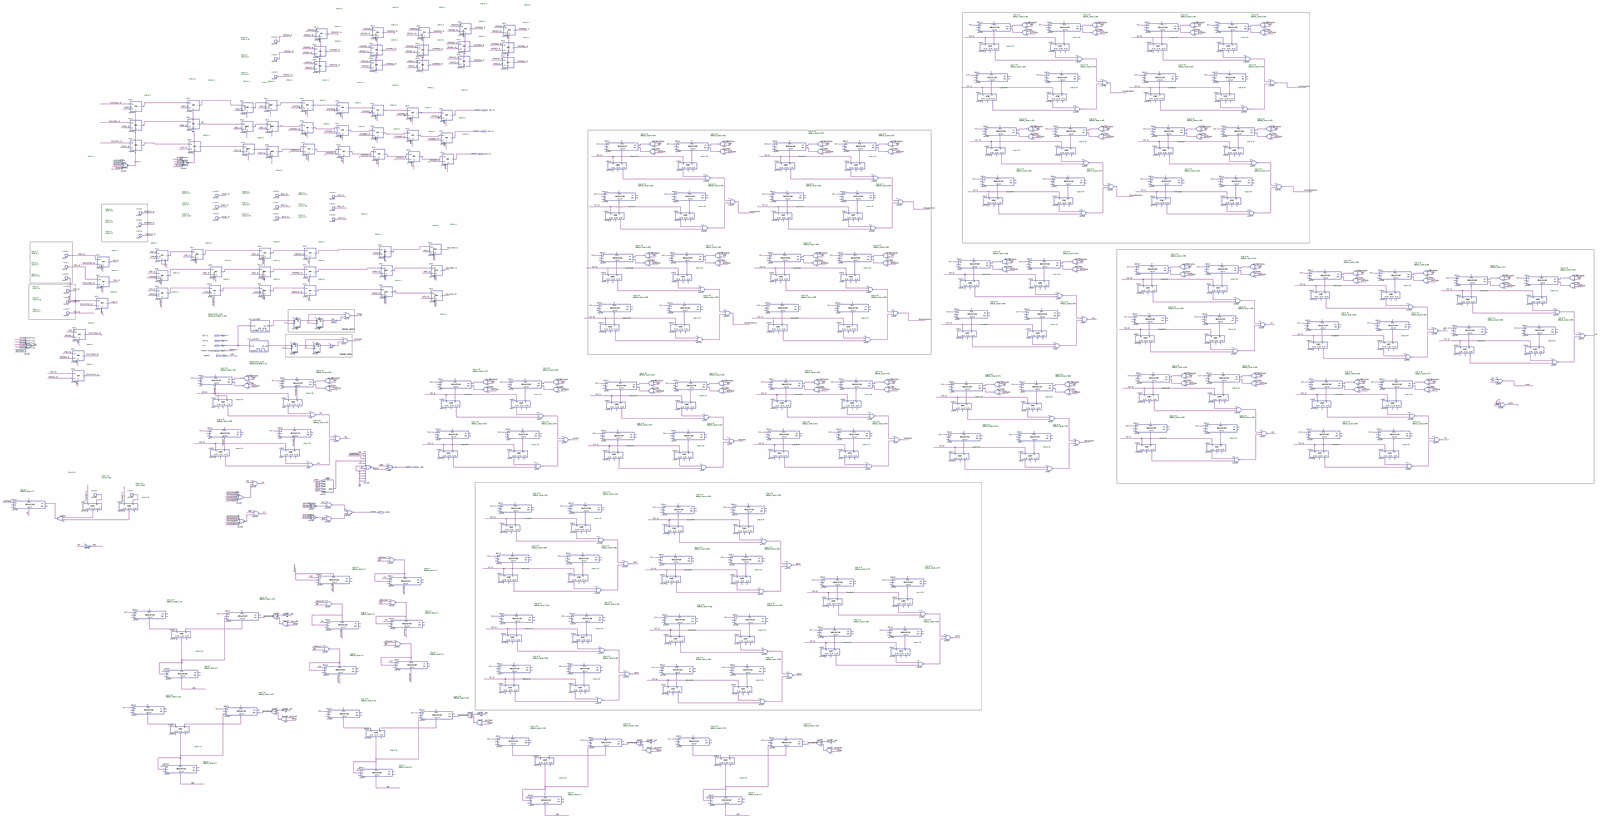
[diagram p0: schematic sheet, whole]
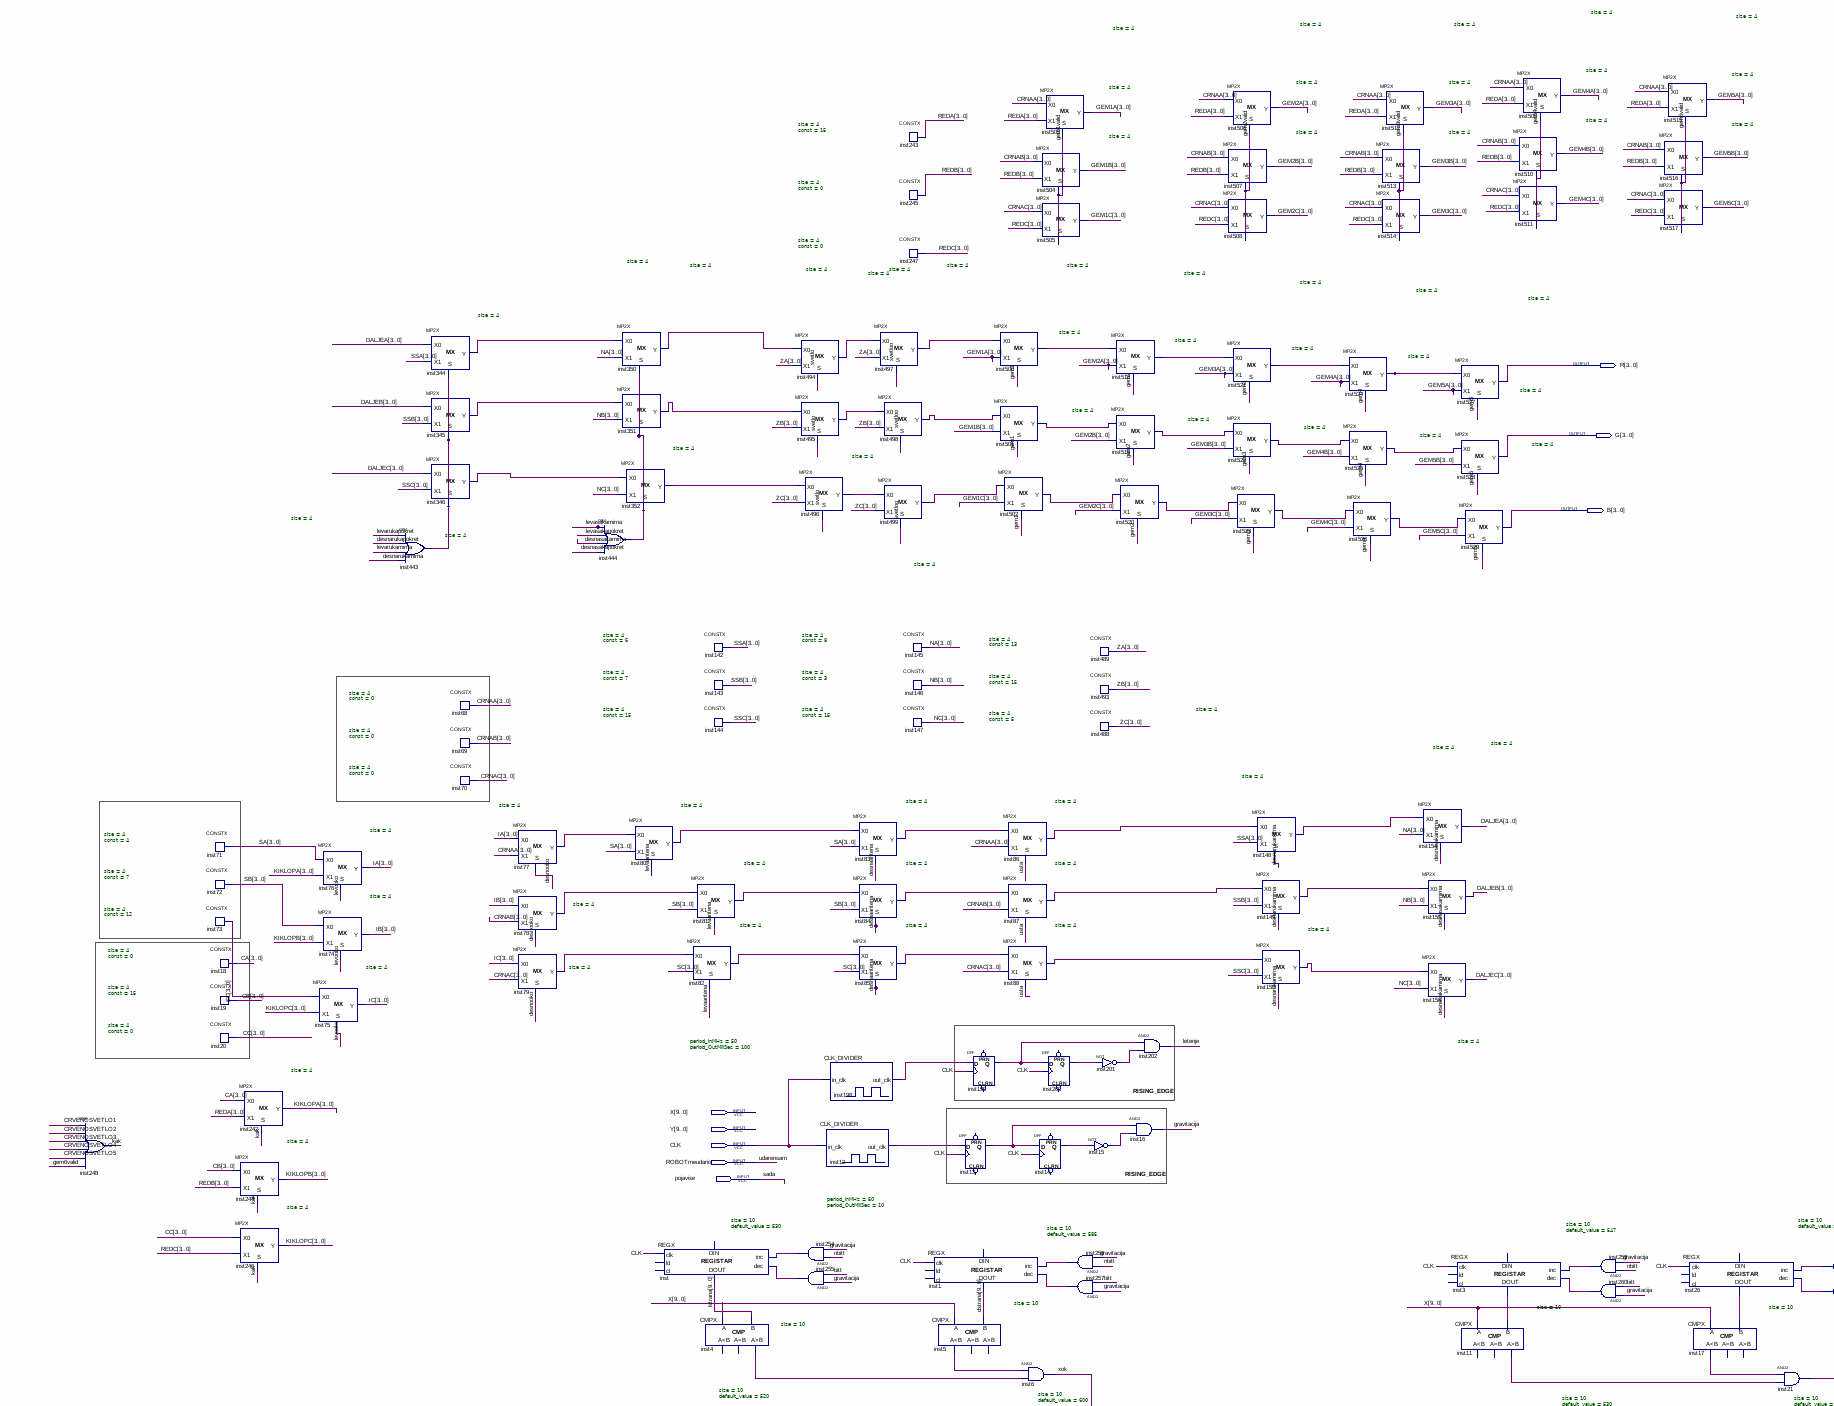
[diagram p1: schematic sheet, upper left part]
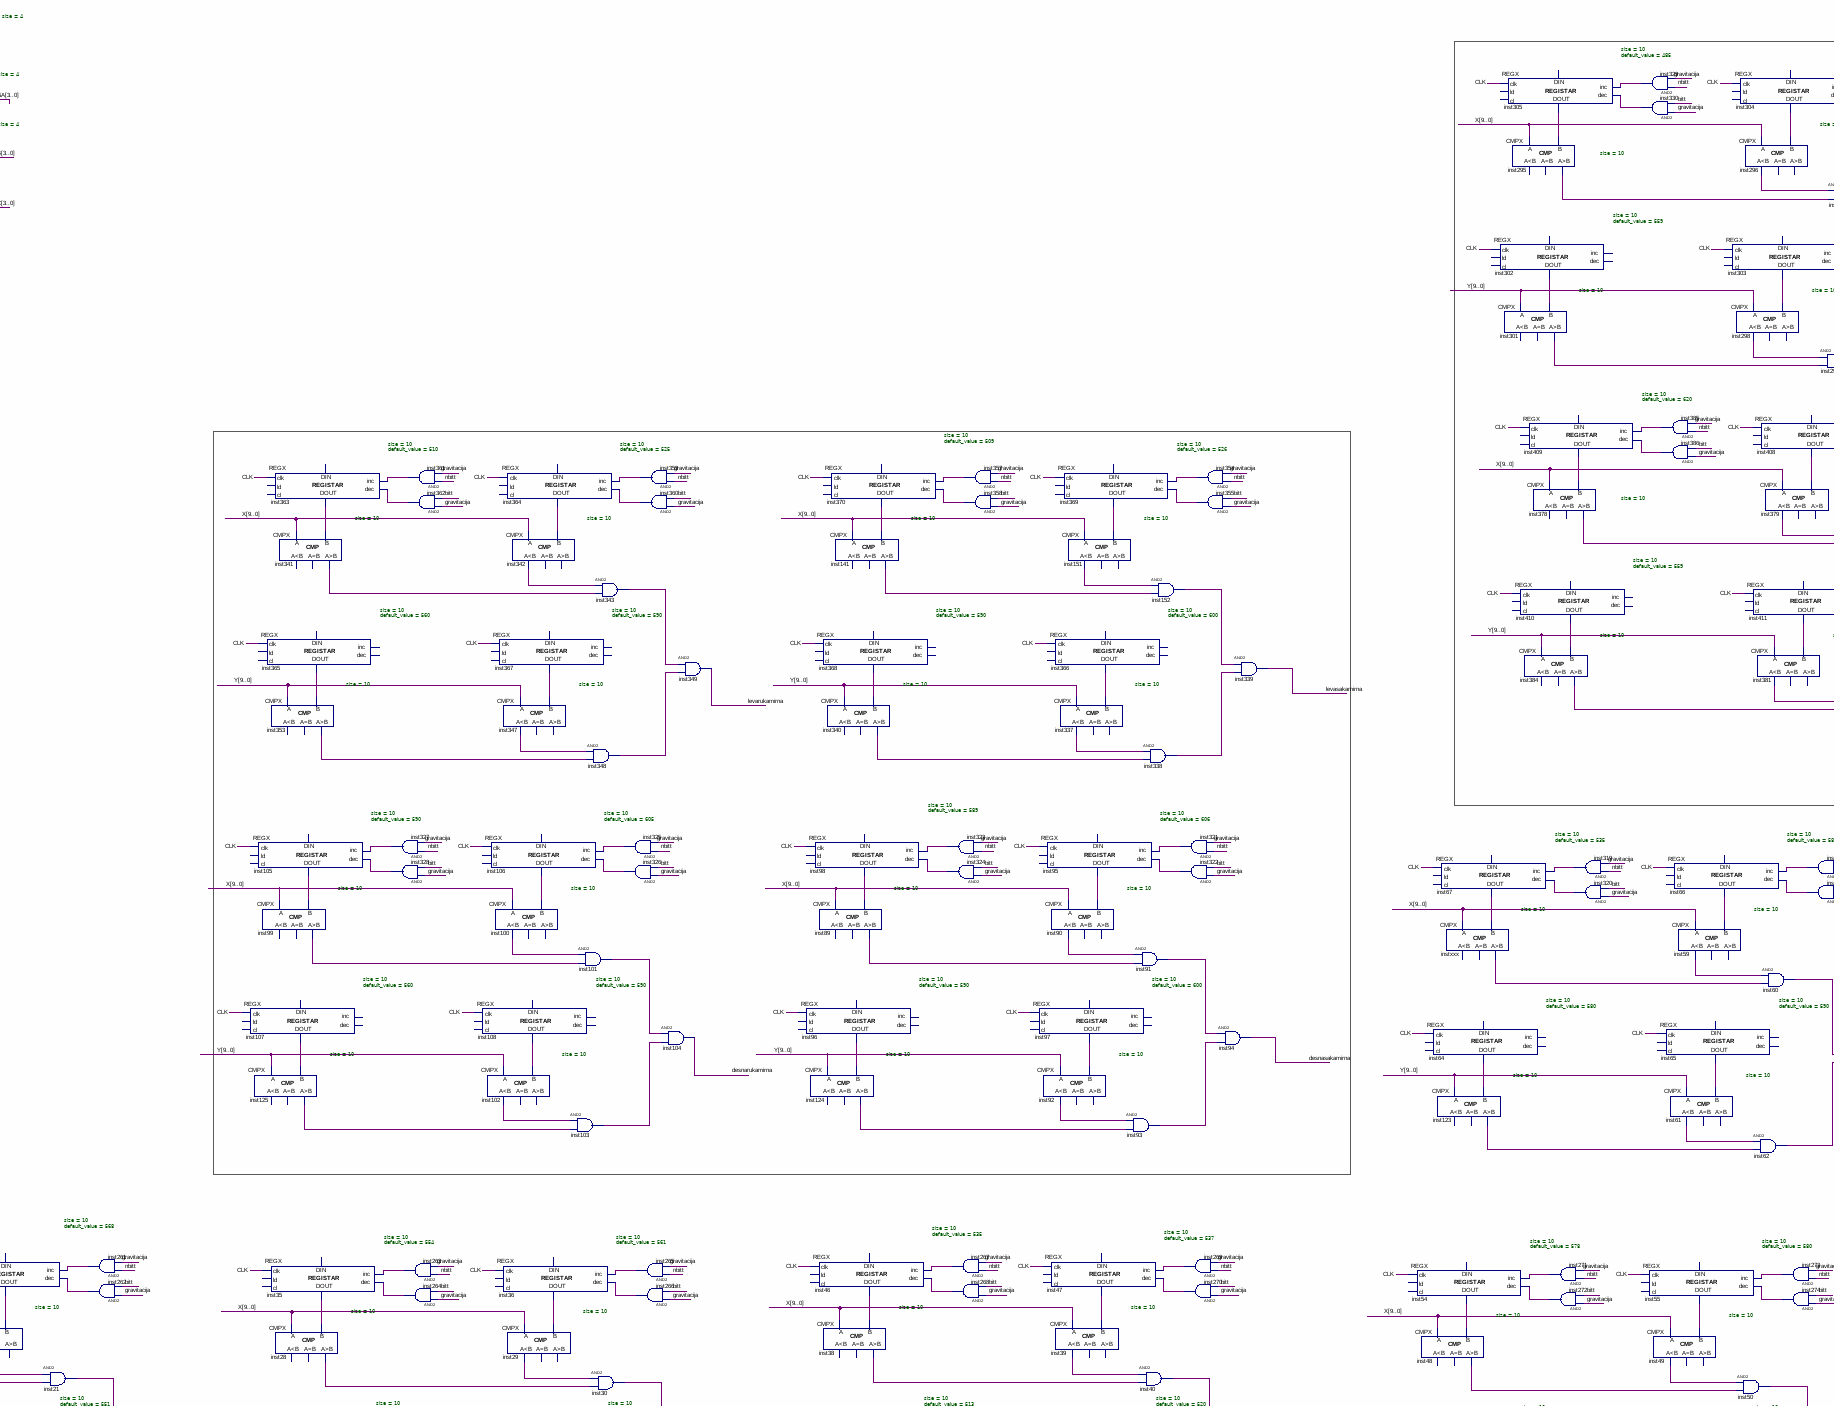
[diagram p2: schematic sheet, upper centre part]
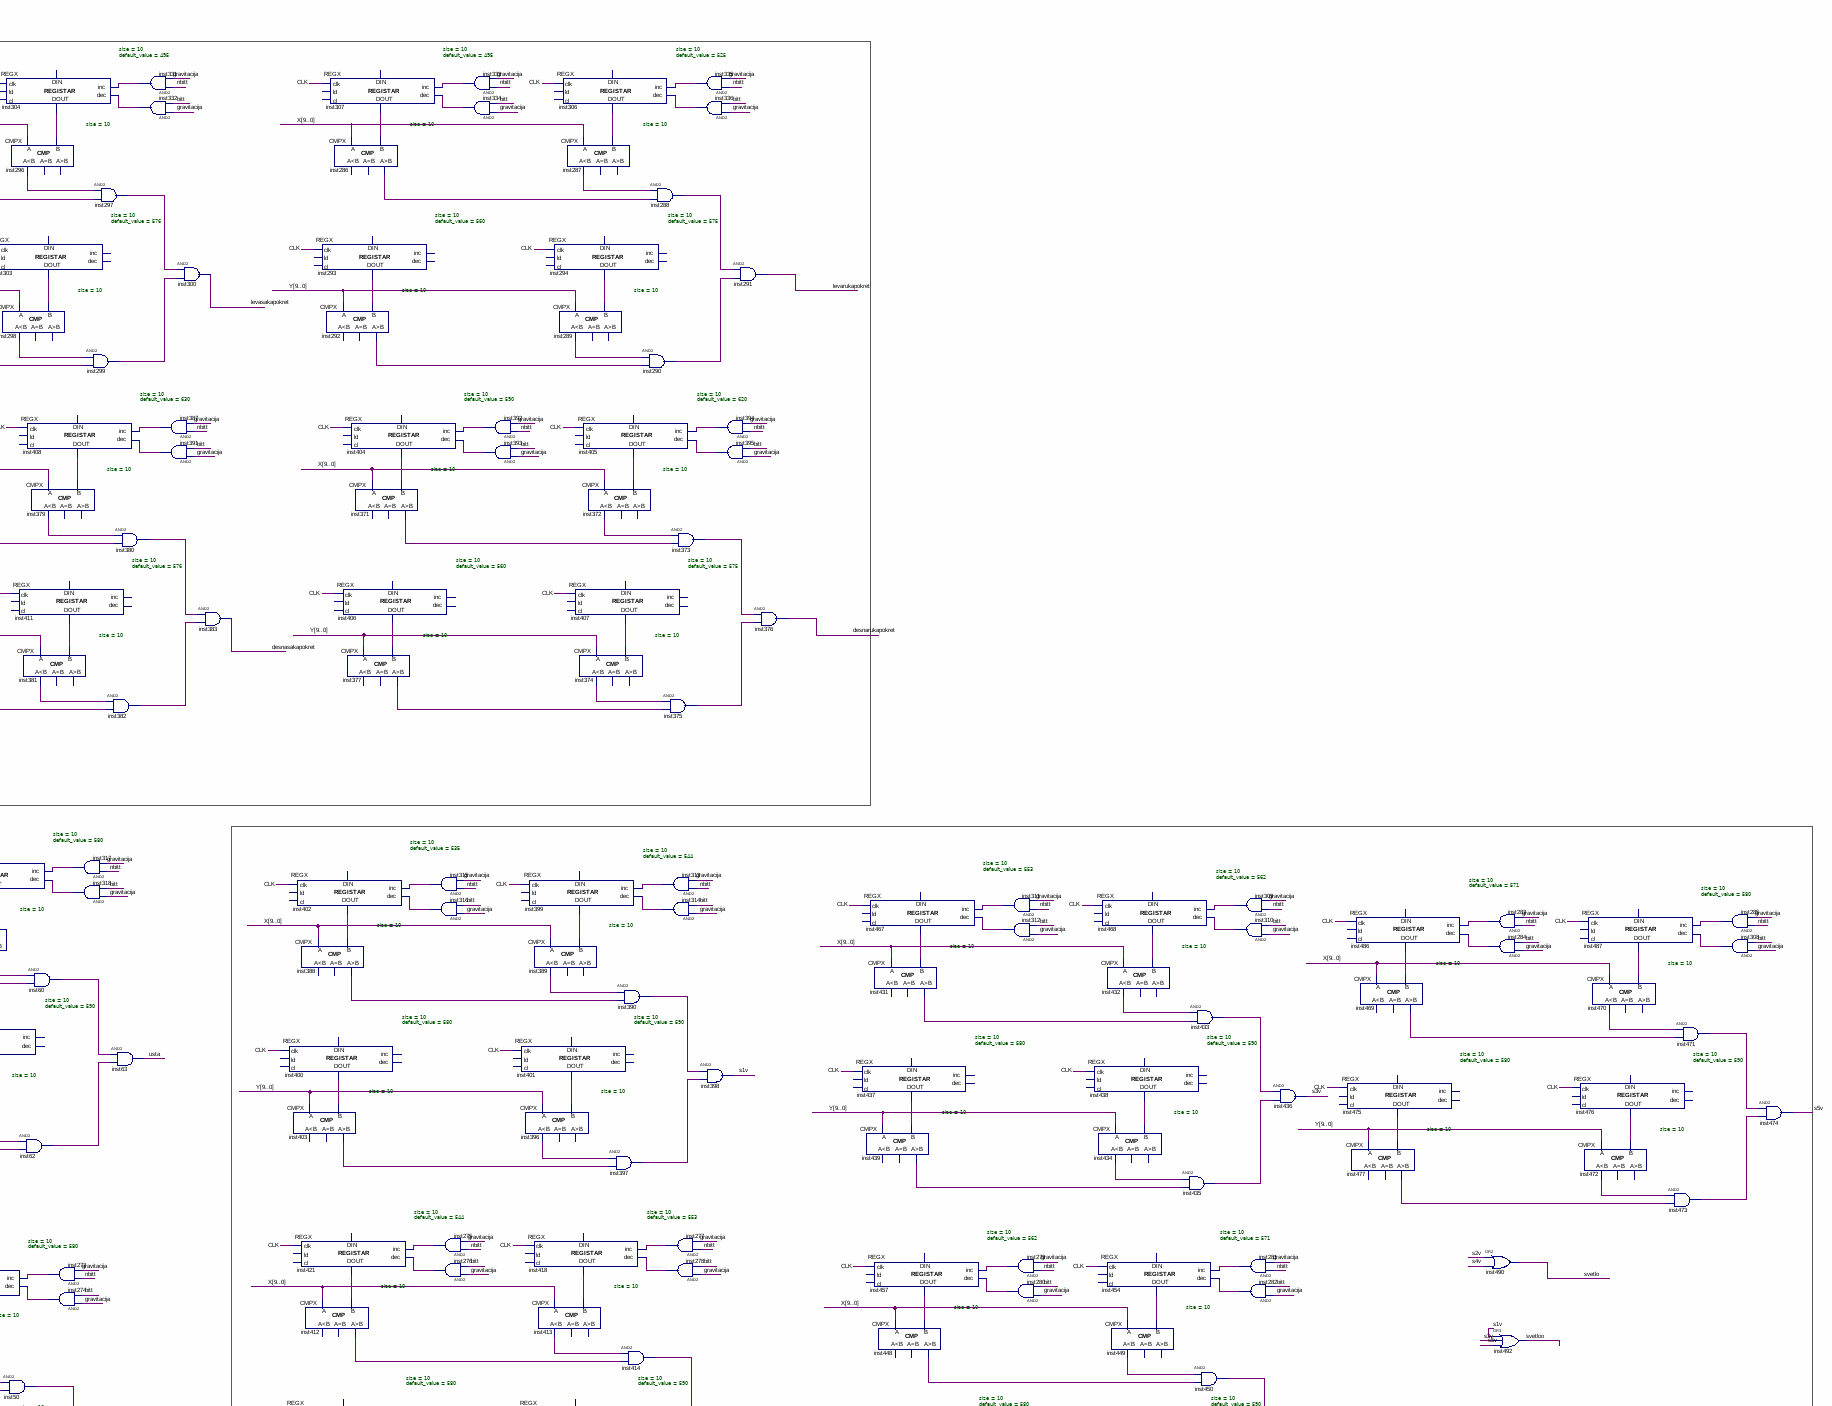
[diagram p3: schematic sheet, upper right part]
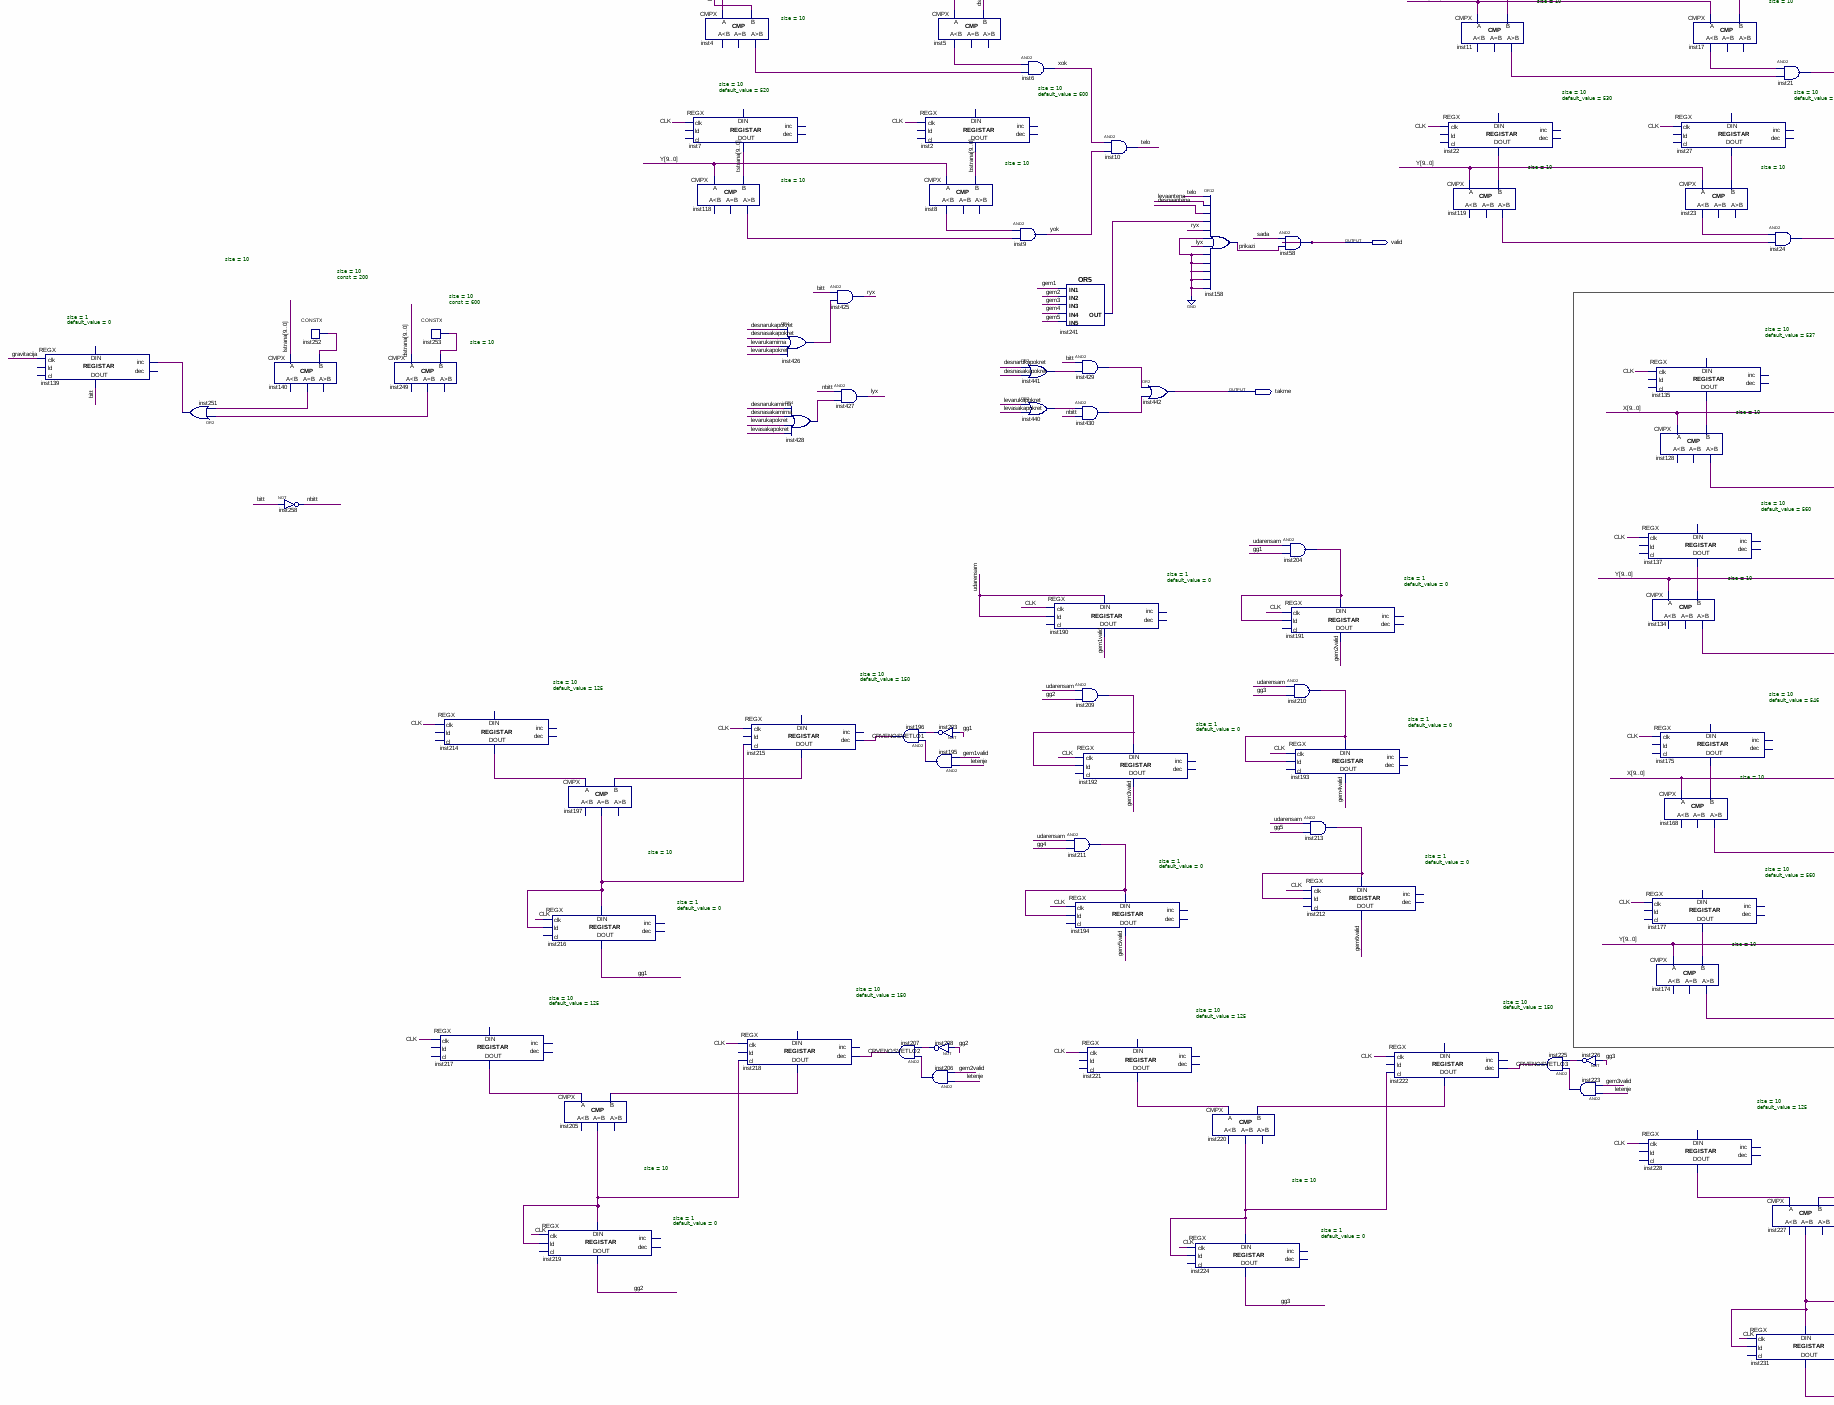
[diagram p4: schematic sheet, lower left part]
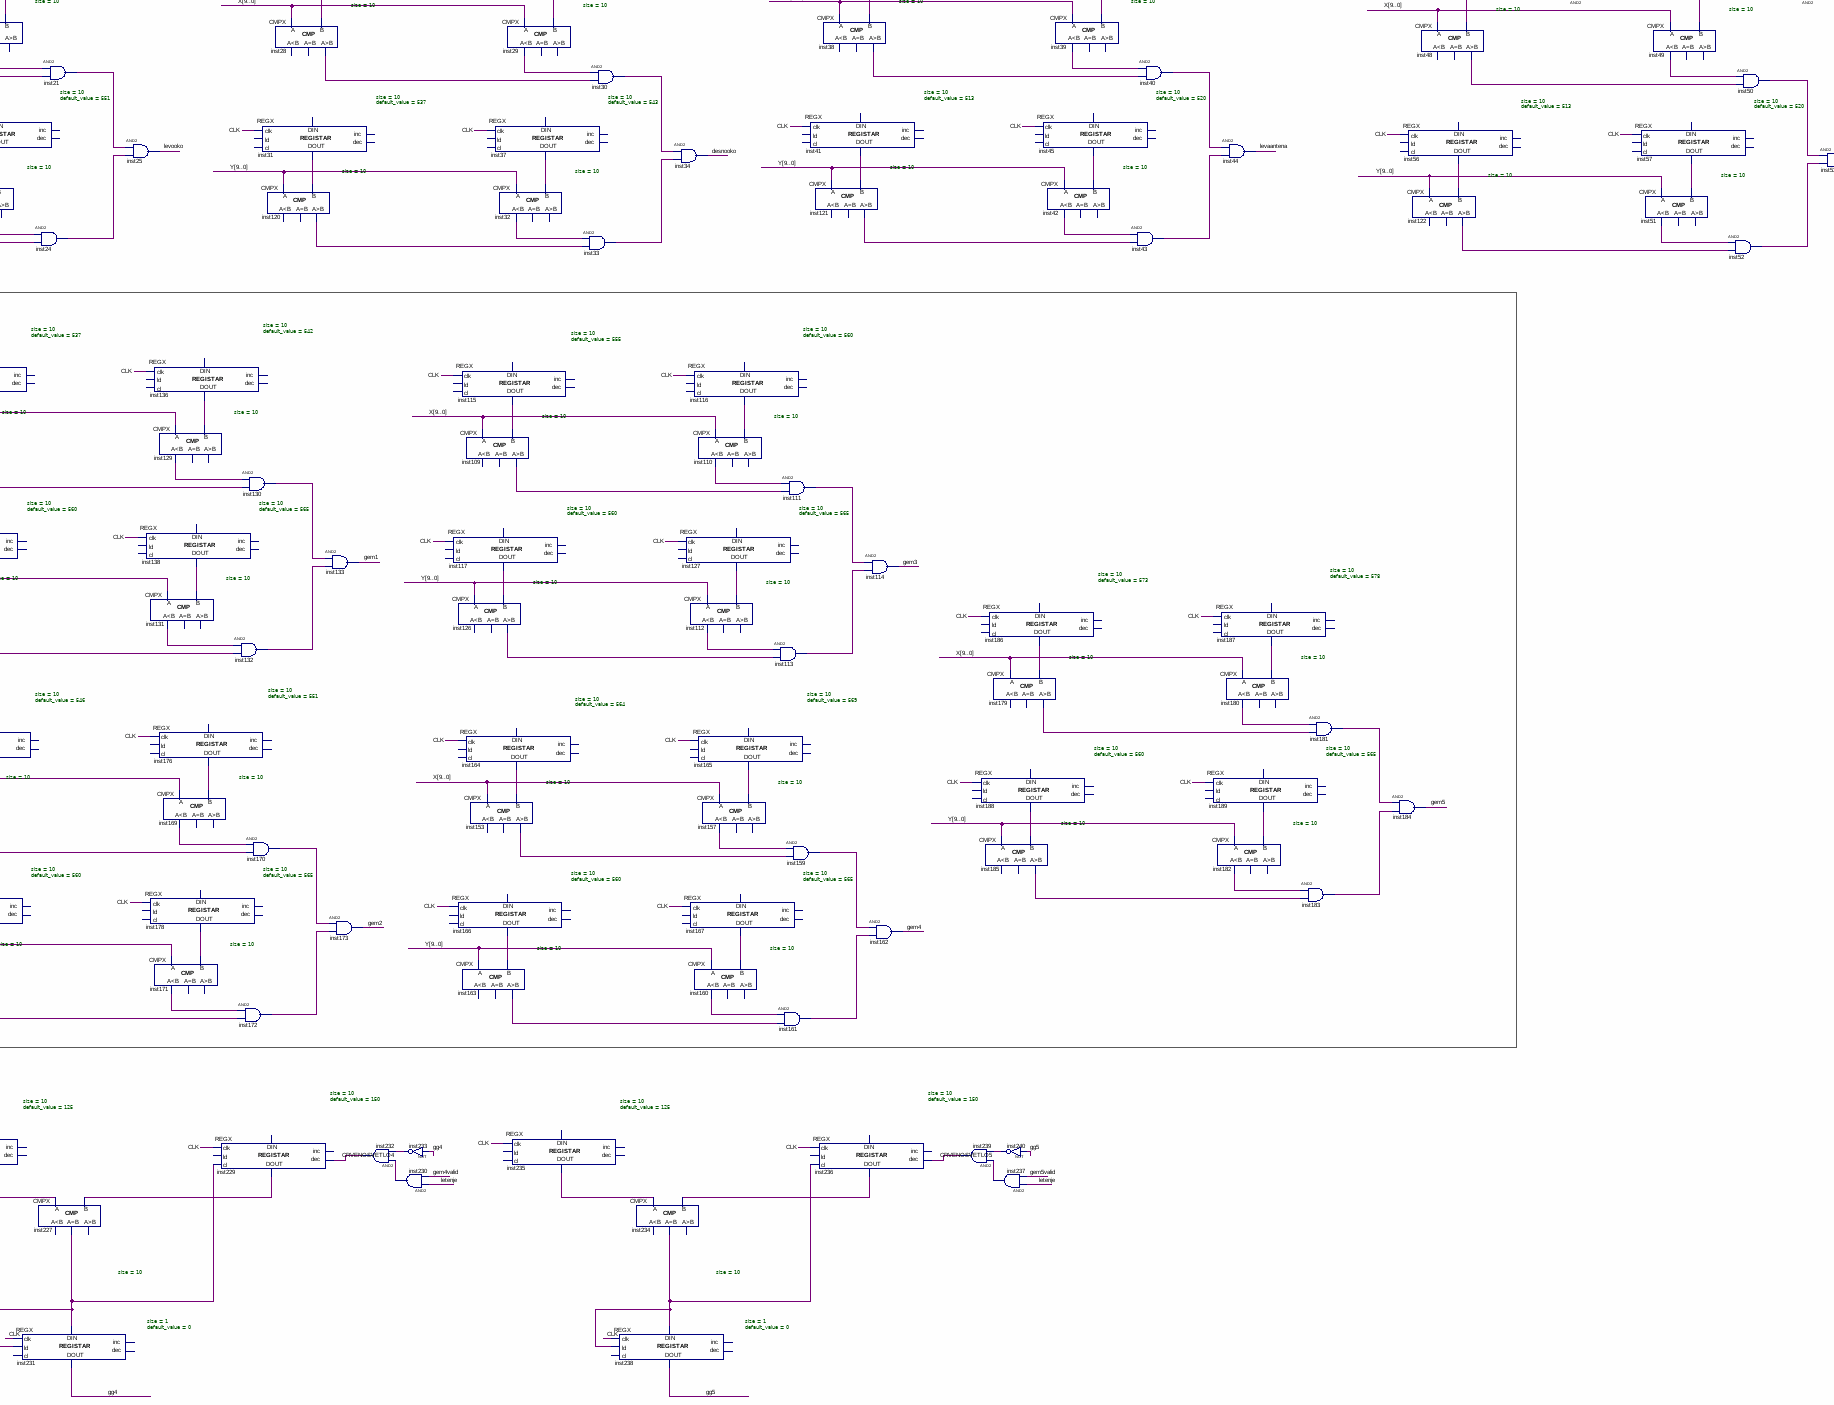
[diagram p5: schematic sheet, lower centre part]
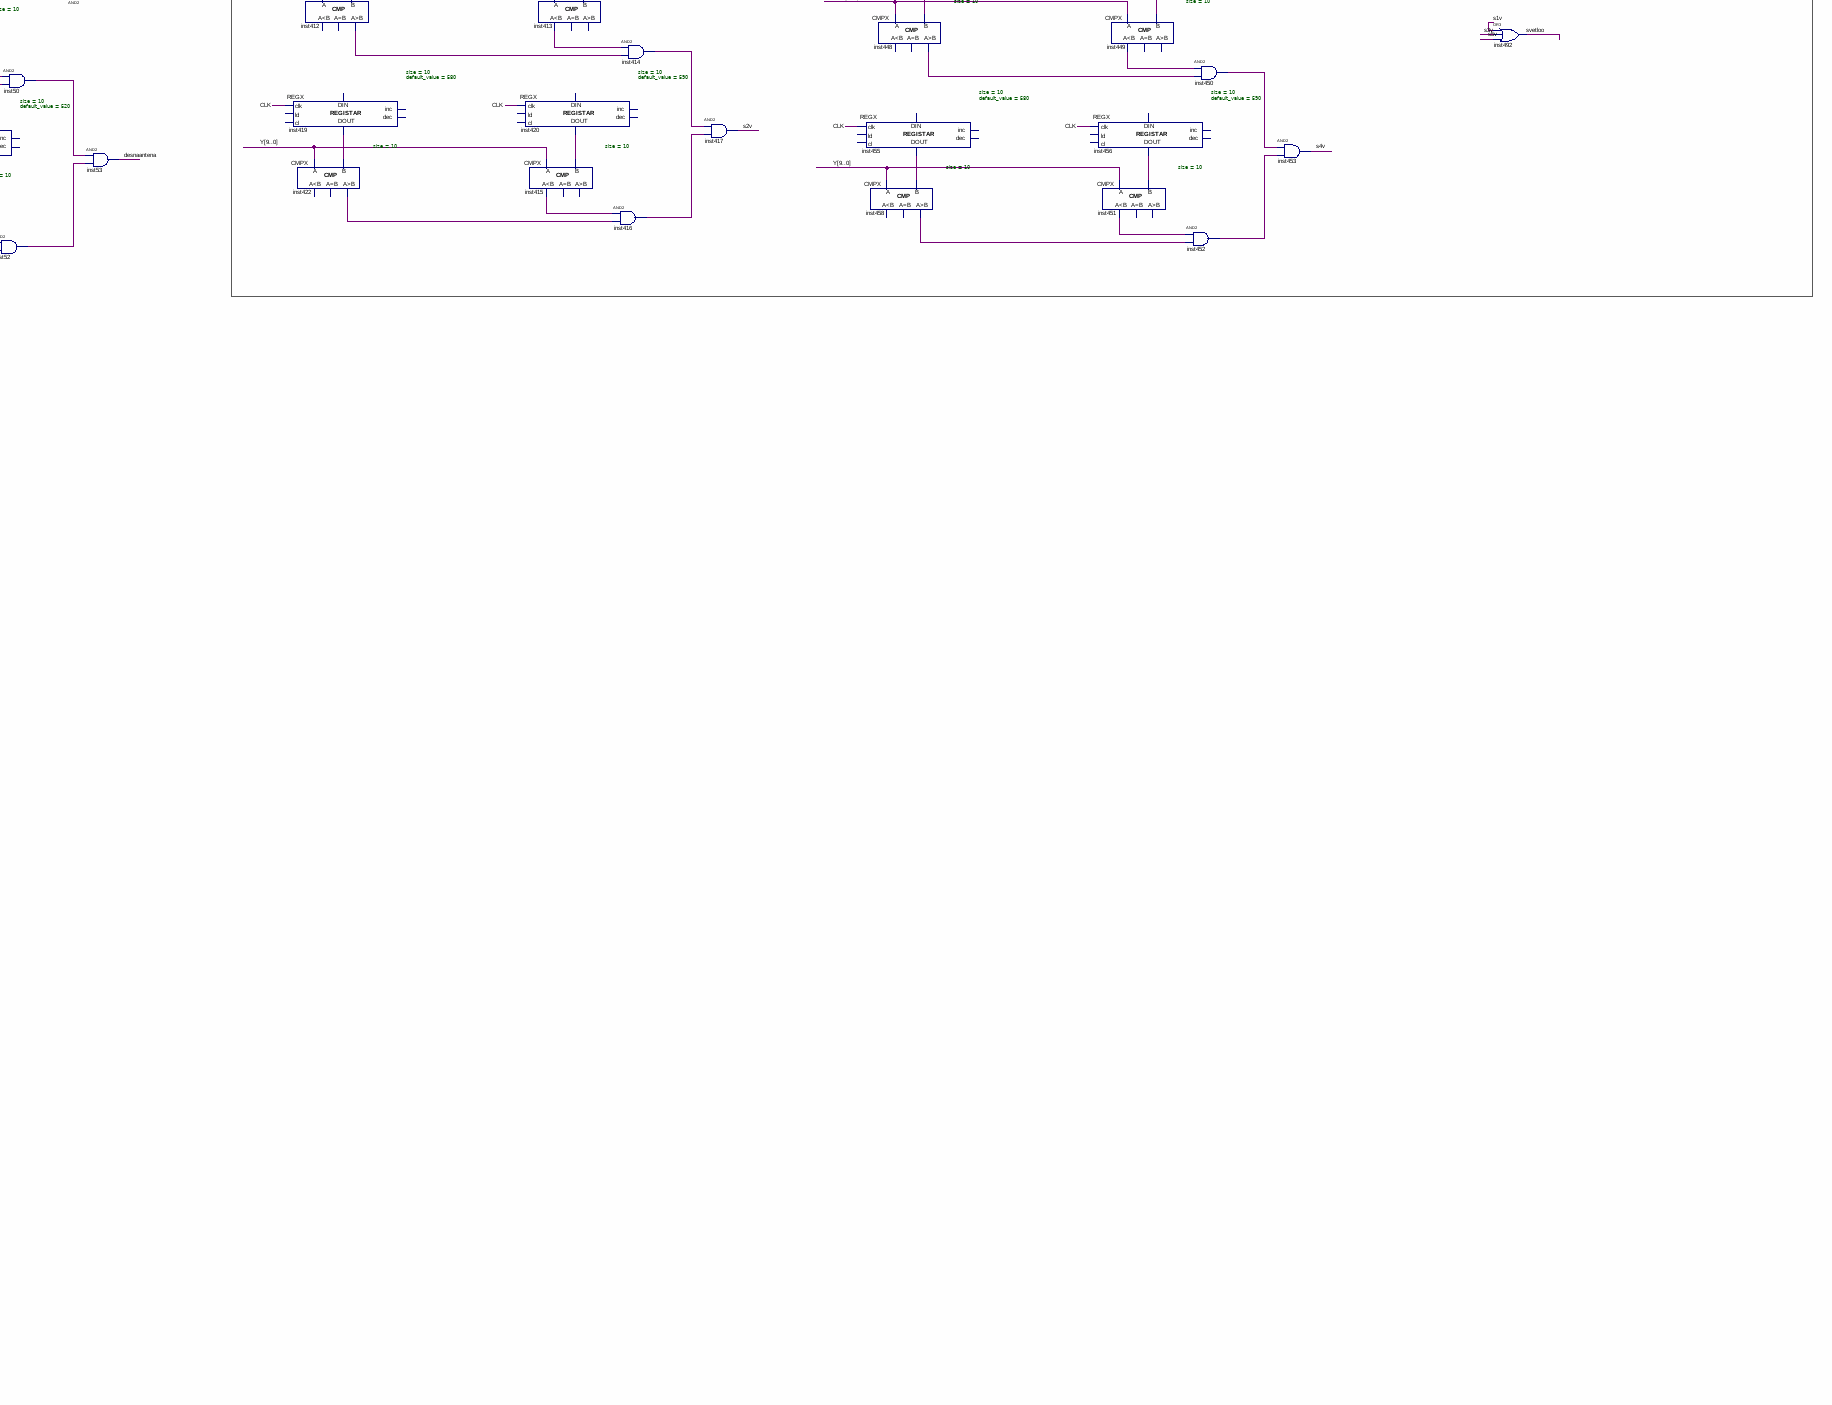
[diagram p6: schematic sheet, lower right part]
// Quartus schematic FINALBOSS.bdf as structural Verilog: 507 symbols, 10 pins
module FINALBOSS (
  input  [9:0] X,
  input  [9:0] Y,
  input  CLK,
  input  ROBOTmeudario,
  input  pojavise,
  output [3:0] R,
  output [3:0] G,
  output [3:0] B,
  output valid,
  output takme
);

  wire bitt, CRVENOSVETLO1, CRVENOSVETLO2, CRVENOSVETLO3, CRVENOSVETLO4, CRVENOSVETLO5, desnaantena,
       desnarukamirna, desnarukapokret, desnasakamirna, desnasakapokret, desnooko, gem1, gem1valid, gem2,
       gem2valid, gem3, gem3valid, gem4, gem4valid, gem5, gem5valid, gem6valid, gg1, gg2, gg3, gg4, gg5,
       gravitacija, inst4_gr, inst5_ls, inst8_ls, inst11_gr, inst12_out_clk, inst13_q, inst14_q, inst15_out,
       inst17_ls, inst21_out, inst23_ls, inst24_out, inst28_gr, inst29_ls, inst30_out, inst32_ls, inst33_out,
       inst38_gr, inst39_ls, inst40_out, inst42_ls, inst43_out, inst48_gr, inst49_ls, inst50_out, inst51_ls,
       inst52_out, inst59_ls, inst60_out, inst61_ls, inst62_out, inst89_gr, inst90_ls, inst91_out, inst92_ls,
       inst93_out, inst99_gr, inst100_ls, inst101_out, inst102_ls, inst103_out, inst109_gr, inst110_ls,
       inst111_out, inst112_ls, inst113_out, inst118_gr, inst119_gr, inst120_gr, inst121_gr, inst122_gr,
       inst123_gr, inst124_gr, inst125_gr, inst126_gr, inst128_gr, inst129_ls, inst130_out, inst131_ls,
       inst132_out, inst134_gr, inst140_eq, inst141_gr, inst151_ls, inst152_out, inst153_gr, inst157_ls,
       inst159_out, inst160_ls, inst161_out, inst163_gr, inst168_gr, inst169_ls, inst170_out, inst171_ls,
       inst172_out, inst174_gr, inst179_gr, inst180_ls, inst181_out, inst182_ls, inst183_out, inst185_gr,
       inst195_out, inst197_eq, inst198_out_clk, inst199_q, inst200_q, inst201_out, inst203_out, inst204_out,
       inst205_eq, inst206_out, inst208_out, inst209_out, inst210_out, inst211_out, inst213_out, inst220_eq,
       inst223_out, inst226_out, inst227_eq, inst230_out, inst233_out, inst234_eq, inst237_out, inst240_out,
       inst241_out, inst249_eq, inst251_out, inst254_out, inst255_out, inst256_out, inst257_out, inst259_out,
       inst260_out, inst261_out, inst262_out, inst263_out, inst264_out, inst265_out, inst266_out,
       inst267_out, inst268_out, inst269_out, inst270_out, inst271_out, inst272_out, inst273_out,
       inst274_out, inst275_out, inst276_out, inst277_out, inst278_out, inst279_out, inst280_out,
       inst281_out, inst282_out, inst283_out, inst284_out, inst285_out, inst286_gr, inst287_ls, inst288_out,
       inst289_ls, inst290_out, inst292_gr, inst295_gr, inst296_ls, inst297_out, inst298_ls, inst299_out,
       inst301_gr, inst308_out, inst309_out, inst310_out, inst311_out, inst312_out, inst313_out, inst314_out,
       inst315_out, inst316_out, inst317_out, inst318_out, inst319_out, inst320_out, inst321_out,
       inst322_out, inst323_out, inst324_out, inst325_out, inst326_out, inst327_out, inst328_out,
       inst329_out, inst330_out, inst331_out, inst332_out, inst333_out, inst334_out, inst335_out,
       inst336_out, inst337_ls, inst338_out, inst340_gr, inst341_gr, inst342_ls, inst343_out, inst347_ls,
       inst348_out, inst353_gr, inst354_out, inst355_out, inst357_out, inst358_out, inst359_out, inst360_out,
       inst361_out, inst362_out, inst371_gr, inst372_ls, inst373_out, inst374_ls, inst375_out, inst377_gr,
       inst378_gr, inst379_ls, inst380_out, inst381_ls, inst382_out, inst384_gr, inst385_out, inst386_out,
       inst387_out, inst388_gr, inst389_ls, inst390_out, inst391_out, inst392_out, inst393_out, inst394_out,
       inst395_out, inst396_ls, inst397_out, inst403_gr, inst412_gr, inst413_ls, inst414_out, inst415_ls,
       inst416_out, inst422_gr, inst426_out, inst428_out, inst429_out, inst430_out, inst431_gr, inst432_ls,
       inst433_out, inst434_ls, inst435_out, inst439_gr, inst440_out, inst441_out, inst443_out, inst444_out,
       inst448_gr, inst449_ls, inst450_out, inst451_ls, inst452_out, inst458_gr, inst469_gr, inst470_ls,
       inst471_out, inst472_ls, inst473_out, inst477_gr, instxxx_gr, kak, letenje, levaantena, levarukamirna,
       levarukapokret, levasakamirna, levasakapokret, levooko, lyx, nbitt, prikazi, ryx, s1v, s2v, s3v, s4v,
       s5v, svetlo, svetloo, telo, usta, xok, yok;
  wire [3:0] CA, CB, CC, CRNAA, CRNAB, CRNAC, DALJEA, DALJEB, DALJEC, GEM1A, GEM1B, GEM1C, GEM2A, GEM2B,
       GEM2C, GEM3A, GEM3B, GEM3C, GEM4A, GEM4B, GEM4C, GEM5A, GEM5B, GEM5C, IA, IB, IC, inst77_y, inst78_y,
       inst79_y, inst80_y, inst81_y, inst82_y, inst83_y, inst84_y, inst85_y, inst86_y, inst87_y, inst88_y,
       inst148_y, inst149_y, inst150_y, inst344_y, inst345_y, inst346_y, inst350_y, inst351_y, inst352_y,
       inst494_y, inst495_y, inst496_y, inst497_y, inst498_y, inst499_y, inst500_y, inst501_y, inst502_y,
       inst518_y, inst519_y, inst520_y, inst521_y, inst522_y, inst523_y, inst524_y, inst525_y, inst526_y,
       KIKLOPA, KIKLOPB, KIKLOPC, NA, NB, NC, REDA, REDB, REDC, SA, SB, SC, SSA, SSB, SSC, ZA, ZB, ZC;
  wire [9:0] bstrana, dstrana, inst3_data_out, inst22_data_out, inst26_data_out, inst27_data_out,
       inst31_data_out, inst35_data_out, inst36_data_out, inst37_data_out, inst41_data_out, inst45_data_out,
       inst46_data_out, inst47_data_out, inst54_data_out, inst55_data_out, inst56_data_out, inst57_data_out,
       inst64_data_out, inst65_data_out, inst66_data_out, inst67_data_out, inst95_data_out, inst96_data_out,
       inst97_data_out, inst98_data_out, inst105_data_out, inst106_data_out, inst107_data_out,
       inst108_data_out, inst115_data_out, inst116_data_out, inst117_data_out, inst127_data_out,
       inst135_data_out, inst136_data_out, inst137_data_out, inst138_data_out, inst164_data_out,
       inst165_data_out, inst166_data_out, inst167_data_out, inst175_data_out, inst176_data_out,
       inst177_data_out, inst178_data_out, inst186_data_out, inst187_data_out, inst188_data_out,
       inst189_data_out, inst214_data_out, inst215_data_out, inst217_data_out, inst218_data_out,
       inst221_data_out, inst222_data_out, inst228_data_out, inst229_data_out, inst235_data_out,
       inst236_data_out, inst252_data, inst253_data, inst293_data_out, inst294_data_out, inst302_data_out,
       inst303_data_out, inst304_data_out, inst305_data_out, inst306_data_out, inst307_data_out,
       inst363_data_out, inst364_data_out, inst365_data_out, inst366_data_out, inst367_data_out,
       inst368_data_out, inst369_data_out, inst370_data_out, inst399_data_out, inst400_data_out,
       inst401_data_out, inst402_data_out, inst404_data_out, inst405_data_out, inst406_data_out,
       inst407_data_out, inst408_data_out, inst409_data_out, inst410_data_out, inst411_data_out,
       inst418_data_out, inst419_data_out, inst420_data_out, inst421_data_out, inst437_data_out,
       inst438_data_out, inst454_data_out, inst455_data_out, inst456_data_out, inst457_data_out,
       inst467_data_out, inst468_data_out, inst475_data_out, inst476_data_out, inst486_data_out,
       inst487_data_out, lstrana, tstrana;

  REGX #(.size(1), .default_value(0)) inst139 (
    .clk(gravitacija), .inc(inst251_out), .data_out(bitt));  // open: ld, cl, dec, data_in
  or inst248 (kak, CRVENOSVETLO1, CRVENOSVETLO2, CRVENOSVETLO3, CRVENOSVETLO4, CRVENOSVETLO5, gem6valid);
  or inst251 (inst251_out, inst249_eq, inst140_eq);
  CONSTX #(.size(4), .\const (4)) inst71 (.data(SA));
  CONSTX #(.size(4), .\const (7)) inst72 (.data(SB));
  CONSTX #(.size(4), .\const (12)) inst73 (.data(SC));
  CONSTX #(.size(4), .\const (0)) inst18 (.data(CA));
  CONSTX #(.size(4), .\const (15)) inst19 (.data(CB));
  CONSTX #(.size(4), .\const (0)) inst20 (.data(CC));
  MP2X #(.size(4)) inst244 (.S(kak), .X0(CB), .X1(REDB), .Y(KIKLOPB));
  MP2X #(.size(4)) inst246 (.S(kak), .X0(CC), .X1(REDC), .Y(KIKLOPC));
  MP2X #(.size(4)) inst242 (.S(kak), .X0(CA), .X1(REDA), .Y(KIKLOPA));
  CMPX #(.size(10)) inst140 (.A(lstrana), .B(inst252_data), .eq(inst140_eq));  // open: ls, gr
  CONSTX #(.size(10), .\const (200)) inst252 (.data(inst252_data));
  not inst258 (nbitt, bitt);
  MP2X #(.size(4)) inst76 (.S(levooko), .X0(SA), .X1(KIKLOPA), .Y(IA));
  MP2X #(.size(4)) inst74 (.S(levooko), .X0(SB), .X1(KIKLOPB), .Y(IB));
  MP2X #(.size(4)) inst75 (.S(levooko), .X0(SC), .X1(KIKLOPC), .Y(IC));
  or inst443 (inst443_out, levarukapokret, desnarukapokret, levarukamirna, desnarukamirna);
  CMPX #(.size(10)) inst249 (.A(dstrana), .B(inst253_data), .eq(inst249_eq));  // open: ls, gr
  MP2X #(.size(4)) inst344 (.S(inst443_out), .X0(DALJEA), .X1(SSA), .Y(inst344_y));
  MP2X #(.size(4)) inst345 (.S(inst443_out), .X0(DALJEB), .X1(SSB), .Y(inst345_y));
  MP2X #(.size(4)) inst346 (.S(inst443_out), .X0(DALJEC), .X1(SSC), .Y(inst346_y));
  CONSTX #(.size(10), .\const (600)) inst253 (.data(inst253_data));
  REGX #(.size(10), .default_value(125)) inst217 (
    .clk(CLK), .data_out(inst217_data_out));  // open: ld, cl, inc, dec, data_in
  CONSTX #(.size(4), .\const (0)) inst68 (.data(CRNAA));
  CONSTX #(.size(4), .\const (0)) inst69 (.data(CRNAB));
  CONSTX #(.size(4), .\const (0)) inst70 (.data(CRNAC));
  REGX #(.size(10), .default_value(125)) inst214 (
    .clk(CLK), .data_out(inst214_data_out));  // open: ld, cl, inc, dec, data_in
  MP2X #(.size(4)) inst77 (.S(desnooko), .X0(IA), .X1(CRNAA), .Y(inst77_y));
  MP2X #(.size(4)) inst78 (.S(desnooko), .X0(IB), .X1(CRNAB), .Y(inst78_y));
  MP2X #(.size(4)) inst79 (.S(desnooko), .X0(IC), .X1(CRNAC), .Y(inst79_y));
  CMPX #(.size(10)) inst197 (.A(inst214_data_out), .B(inst215_data_out), .eq(inst197_eq));  // open: ls, gr
  REGX #(.size(1), .default_value(0)) inst216 (
    .clk(CLK), .ld(inst197_eq), .data_in(inst197_eq), .data_out(gg1));  // open: cl, inc, dec
  CMPX #(.size(10)) inst205 (.A(inst217_data_out), .B(inst218_data_out), .eq(inst205_eq));  // open: ls, gr
  REGX #(.size(1), .default_value(0)) inst219 (
    .clk(CLK), .ld(inst205_eq), .data_in(inst205_eq), .data_out(gg2));  // open: cl, inc, dec
  or inst444 (inst444_out, levasakamirna, levasakapokret, desnasakamirna, desnasakapokret);
  MP2X #(.size(4)) inst350 (.S(inst444_out), .X0(inst344_y), .X1(NA), .Y(inst350_y));
  MP2X #(.size(4)) inst351 (.S(inst444_out), .X0(inst345_y), .X1(NB), .Y(inst351_y));
  MP2X #(.size(4)) inst352 (.S(inst444_out), .X0(inst346_y), .X1(NC), .Y(inst352_y));
  MP2X #(.size(4)) inst80 (.S(levaantena), .X0(inst77_y), .X1(SA), .Y(inst80_y));
  REGX #(.size(10), .default_value(530)) inst (
    .clk(CLK), .inc(inst254_out), .dec(inst255_out), .data_out(lstrana));  // open: ld, cl, data_in
  MP2X #(.size(4)) inst81 (.S(levaantena), .X0(inst78_y), .X1(SB), .Y(inst81_y));
  MP2X #(.size(4)) inst82 (.S(levaantena), .X0(inst79_y), .X1(SC), .Y(inst82_y));
  CMPX #(.size(10)) inst4 (.A(X), .B(lstrana), .gr(inst4_gr));  // open: ls, eq
  REGX #(.size(10), .default_value(520)) inst7 (.clk(CLK), .data_out(tstrana));  // open: ld, cl, inc, dec, data_in
  CMPX #(.size(10)) inst118 (.A(Y), .B(tstrana), .gr(inst118_gr));  // open: ls, eq
  CONSTX #(.size(4), .\const (6)) inst142 (.data(SSA));
  CONSTX #(.size(4), .\const (7)) inst143 (.data(SSB));
  CONSTX #(.size(4), .\const (15)) inst144 (.data(SSC));
  REGX #(.size(10), .default_value(150)) inst215 (
    .clk(CLK), .cl(inst197_eq), .dec(CRVENOSVETLO1), .data_out(inst215_data_out));  // open: ld, inc, data_in
  REGX #(.size(10), .default_value(150)) inst218 (
    .clk(CLK), .cl(inst205_eq), .dec(CRVENOSVETLO2), .data_out(inst218_data_out));  // open: ld, inc, data_in
  MP2X #(.size(4)) inst494 (.S(svetlo), .X0(inst350_y), .X1(ZA), .Y(inst494_y));
  MP2X #(.size(4)) inst495 (.S(svetlo), .X0(inst351_y), .X1(ZB), .Y(inst495_y));
  MP2X #(.size(4)) inst496 (.S(svetlo), .X0(inst352_y), .X1(ZC), .Y(inst496_y));
  and inst254 (inst254_out, nbitt, gravitacija);
  and inst255 (inst255_out, gravitacija, bitt);
  or inst426 (inst426_out, desnarukapokret, desnasakapokret, levarukamirna, levarukapokret);
  or inst428 (inst428_out, desnarukamirna, desnasakamirna, levarukapokret, levasakapokret);
  CLK_DIVIDER #(.period_InMHz(50), .period_OutMiliSec(100)) inst198 (.in_clk(CLK), .out_clk(inst198_out_clk));
  CLK_DIVIDER #(.period_InMHz(50), .period_OutMiliSec(10)) inst12 (.in_clk(CLK), .out_clk(inst12_out_clk));
  and inst425 (ryx, bitt, inst426_out);
  MP2X #(.size(4)) inst83 (.S(desnaantena), .X0(inst80_y), .X1(SA), .Y(inst83_y));
  MP2X #(.size(4)) inst84 (.S(desnaantena), .X0(inst81_y), .X1(SB), .Y(inst84_y));
  MP2X #(.size(4)) inst85 (.S(desnaantena), .X0(inst82_y), .X1(SC), .Y(inst85_y));
  and inst427 (lyx, nbitt, inst428_out);
  CONSTX #(.size(4), .\const (15)) inst243 (.data(REDA));
  CONSTX #(.size(4), .\const (0)) inst245 (.data(REDB));
  CONSTX #(.size(4), .\const (0)) inst247 (.data(REDC));
  MP2X #(.size(4)) inst497 (.S(svetloo), .X0(inst494_y), .X1(ZA), .Y(inst497_y));
  MP2X #(.size(4)) inst498 (.S(svetloo), .X0(inst495_y), .X1(ZB), .Y(inst498_y));
  MP2X #(.size(4)) inst499 (.S(svetloo), .X0(inst496_y), .X1(ZC), .Y(inst499_y));
  and inst196 (CRVENOSVETLO1, inst195_out, inst203_out);
  and inst207 (CRVENOSVETLO2, inst206_out, inst208_out);
  CONSTX #(.size(4), .\const (8)) inst145 (.data(NA));
  CONSTX #(.size(4), .\const (3)) inst146 (.data(NB));
  CONSTX #(.size(4), .\const (15)) inst147 (.data(NC));
  REGX #(.size(10), .default_value(585)) inst1 (
    .clk(CLK), .inc(inst256_out), .dec(inst257_out), .data_out(dstrana));  // open: ld, cl, data_in
  CMPX #(.size(10)) inst5 (.A(X), .B(dstrana), .ls(inst5_ls));  // open: eq, gr
  REGX #(.size(10), .default_value(600)) inst2 (.clk(CLK), .data_out(bstrana));  // open: ld, cl, inc, dec, data_in
  CMPX #(.size(10)) inst8 (.A(Y), .B(bstrana), .ls(inst8_ls));  // open: eq, gr
  and inst195 (inst195_out, letenje, gem1valid);
  not inst208 (inst208_out, gg2);
  and inst206 (inst206_out, letenje, gem2valid);
  DFF inst13 (.CLK(CLK), .D(inst12_out_clk), .Q(inst13_q));  // open: CLRN, PRN
  not inst203 (inst203_out, gg1);
  MP2X #(.size(4)) inst500 (.S(gem1), .X0(inst497_y), .X1(GEM1A), .Y(inst500_y));
  MP2X #(.size(4)) inst501 (.S(gem1), .X0(inst498_y), .X1(GEM1B), .Y(inst501_y));
  MP2X #(.size(4)) inst502 (.S(gem1), .X0(inst499_y), .X1(GEM1C), .Y(inst502_y));
  DFF inst199 (.CLK(CLK), .D(inst198_out_clk), .Q(inst199_q));  // open: CLRN, PRN
  MP2X #(.size(4)) inst86 (.S(usta), .X0(inst83_y), .X1(CRNAA), .Y(inst86_y));
  MP2X #(.size(4)) inst87 (.S(usta), .X0(inst84_y), .X1(CRNAB), .Y(inst87_y));
  MP2X #(.size(4)) inst88 (.S(usta), .X0(inst85_y), .X1(CRNAC), .Y(inst88_y));
  and inst6 (xok, inst5_ls, inst4_gr);
  and inst9 (yok, inst8_ls, inst118_gr);
  or inst441 (inst441_out, desnarukapokret, desnasakapokret);
  or inst440 (inst440_out, levarukapokret, levasakapokret);
  MP2X #(.size(4)) inst503 (.S(gem1valid), .X0(CRNAA), .X1(REDA), .Y(GEM1A));
  MP2X #(.size(4)) inst504 (.S(gem1valid), .X0(CRNAB), .X1(REDB), .Y(GEM1B));
  MP2X #(.size(4)) inst505 (.S(gem1valid), .X0(CRNAC), .X1(REDC), .Y(GEM1C));
  DFF inst200 (.CLK(CLK), .D(inst199_q), .Q(inst200_q));  // open: CLRN, PRN
  DFF inst14 (.CLK(CLK), .D(inst13_q), .Q(inst14_q));  // open: CLRN, PRN
  or inst241 (inst241_out, gem1, gem2, gem3, gem4, gem5);
  REGX #(.size(1), .default_value(0)) inst190 (
    .clk(CLK), .ld(ROBOTmeudario), .data_in(ROBOTmeudario), .data_out(gem1valid));  // open: cl, inc, dec
  CONSTX #(.size(4), .\const (13)) inst489 (.data(ZA));
  CONSTX #(.size(4), .\const (15)) inst493 (.data(ZB));
  CONSTX #(.size(4), .\const (5)) inst488 (.data(ZC));
  not inst201 (inst201_out, inst200_q);
  not inst15 (inst15_out, inst14_q);
  and inst256 (inst256_out, nbitt, gravitacija);
  and inst257 (inst257_out, gravitacija, bitt);
  and inst429 (inst429_out, bitt, inst441_out);
  and inst430 (inst430_out, inst440_out, nbitt);
  and inst209 (inst209_out, ROBOTmeudario, gg2);
  REGX #(.size(1), .default_value(0)) inst192 (
    .clk(CLK), .ld(inst209_out), .data_in(inst209_out), .data_out(gem3valid));  // open: cl, inc, dec
  and inst211 (inst211_out, ROBOTmeudario, gg4);
  REGX #(.size(1), .default_value(0)) inst194 (
    .clk(CLK), .ld(inst211_out), .data_in(inst211_out), .data_out(gem5valid));  // open: cl, inc, dec
  REGX #(.size(10), .default_value(125)) inst221 (
    .clk(CLK), .data_out(inst221_data_out));  // open: ld, cl, inc, dec, data_in
  MP2X #(.size(4)) inst518 (.S(gem2), .X0(inst500_y), .X1(GEM2A), .Y(inst518_y));
  MP2X #(.size(4)) inst519 (.S(gem2), .X0(inst501_y), .X1(GEM2B), .Y(inst519_y));
  MP2X #(.size(4)) inst520 (.S(gem2), .X0(inst502_y), .X1(GEM2C), .Y(inst520_y));
  and inst16 (gravitacija, inst13_q, inst15_out);
  and inst10 (telo, xok, yok);
  and inst202 (letenje, inst199_q, inst201_out);
  or inst442 (takme, inst429_out, inst430_out);
  REGX #(.size(1), .default_value(0)) inst224 (
    .clk(CLK), .ld(inst220_eq), .data_in(inst220_eq), .data_out(gg3));  // open: cl, inc, dec
  MP2X #(.size(4)) inst506 (.S(gem2valid), .X0(CRNAA), .X1(REDA), .Y(GEM2A));
  MP2X #(.size(4)) inst507 (.S(gem2valid), .X0(CRNAB), .X1(REDB), .Y(GEM2B));
  MP2X #(.size(4)) inst508 (.S(gem2valid), .X0(CRNAC), .X1(REDC), .Y(GEM2C));
  MP2X #(.size(4)) inst521 (.S(gem3), .X0(inst518_y), .X1(GEM3A), .Y(inst521_y));
  MP2X #(.size(4)) inst522 (.S(gem3), .X0(inst519_y), .X1(GEM3B), .Y(inst522_y));
  MP2X #(.size(4)) inst523 (.S(gem3), .X0(inst520_y), .X1(GEM3C), .Y(inst523_y));
  or inst158 (prikazi, telo, levaantena, desnaantena, inst241_out, ryx, 1'b0, lyx, 1'b0, 1'b0, 1'b0, 1'b0, 1'b0);
  CMPX #(.size(10)) inst220 (.A(inst221_data_out), .B(inst222_data_out), .eq(inst220_eq));  // open: ls, gr
  MP2X #(.size(4)) inst148 (.S(desnarukamirna), .X0(inst86_y), .X1(SSA), .Y(inst148_y));
  MP2X #(.size(4)) inst149 (.S(desnarukamirna), .X0(inst87_y), .X1(SSB), .Y(inst149_y));
  MP2X #(.size(4)) inst150 (.S(desnarukamirna), .X0(inst88_y), .X1(SSC), .Y(inst150_y));
  and inst58 (valid, pojavise, prikazi);
  and inst204 (inst204_out, ROBOTmeudario, gg1);
  REGX #(.size(1), .default_value(0)) inst191 (
    .clk(CLK), .ld(inst204_out), .data_in(inst204_out), .data_out(gem2valid));  // open: cl, inc, dec
  and inst210 (inst210_out, ROBOTmeudario, gg3);
  REGX #(.size(1), .default_value(0)) inst193 (
    .clk(CLK), .ld(inst210_out), .data_in(inst210_out), .data_out(gem4valid));  // open: cl, inc, dec
  and inst213 (inst213_out, ROBOTmeudario, gg5);
  REGX #(.size(1), .default_value(0)) inst212 (
    .clk(CLK), .ld(inst213_out), .data_in(inst213_out), .data_out(gem6valid));  // open: cl, inc, dec
  MP2X #(.size(4)) inst524 (.S(gem4), .X0(inst521_y), .X1(GEM4A), .Y(inst524_y));
  MP2X #(.size(4)) inst525 (.S(gem4), .X0(inst522_y), .X1(GEM4B), .Y(inst525_y));
  MP2X #(.size(4)) inst526 (.S(gem4), .X0(inst523_y), .X1(GEM4C), .Y(inst526_y));
  MP2X #(.size(4)) inst512 (.S(gem3valid), .X0(CRNAA), .X1(REDA), .Y(GEM3A));
  MP2X #(.size(4)) inst513 (.S(gem3valid), .X0(CRNAB), .X1(REDB), .Y(GEM3B));
  MP2X #(.size(4)) inst514 (.S(gem3valid), .X0(CRNAC), .X1(REDC), .Y(GEM3C));
  REGX #(.size(10), .default_value(150)) inst222 (
    .clk(CLK), .cl(inst220_eq), .dec(CRVENOSVETLO3), .data_out(inst222_data_out));  // open: ld, inc, data_in
  MP2X #(.size(4)) inst154 (.S(desnasakamirna), .X0(inst148_y), .X1(NA), .Y(DALJEA));
  MP2X #(.size(4)) inst155 (.S(desnasakamirna), .X0(inst149_y), .X1(NB), .Y(DALJEB));
  MP2X #(.size(4)) inst156 (.S(desnasakamirna), .X0(inst150_y), .X1(NC), .Y(DALJEC));
  MP2X #(.size(4)) inst527 (.S(gem5), .X0(inst524_y), .X1(GEM5A), .Y(R));
  MP2X #(.size(4)) inst528 (.S(gem5), .X0(inst525_y), .X1(GEM5B), .Y(G));
  MP2X #(.size(4)) inst529 (.S(gem5), .X0(inst526_y), .X1(GEM5C), .Y(B));
  REGX #(.size(10), .default_value(547)) inst3 (
    .clk(CLK), .inc(inst259_out), .dec(inst260_out), .data_out(inst3_data_out));  // open: ld, cl, data_in
  CMPX #(.size(10)) inst11 (.A(X), .B(inst3_data_out), .gr(inst11_gr));  // open: ls, eq
  REGX #(.size(10), .default_value(530)) inst22 (
    .clk(CLK), .data_out(inst22_data_out));  // open: ld, cl, inc, dec, data_in
  CMPX #(.size(10)) inst119 (.A(Y), .B(inst22_data_out), .gr(inst119_gr));  // open: ls, eq
  MP2X #(.size(4)) inst509 (.S(gem4valid), .X0(CRNAA), .X1(REDA), .Y(GEM4A));
  MP2X #(.size(4)) inst510 (.S(gem4valid), .X0(CRNAB), .X1(REDB), .Y(GEM4B));
  MP2X #(.size(4)) inst511 (.S(gem4valid), .X0(CRNAC), .X1(REDC), .Y(GEM4C));
  and inst225 (CRVENOSVETLO3, inst223_out, inst226_out);
  and inst259 (inst259_out, nbitt, gravitacija);
  and inst260 (inst260_out, gravitacija, bitt);
  not inst226 (inst226_out, gg3);
  and inst223 (inst223_out, letenje, gem3valid);
  MP2X #(.size(4)) inst515 (.S(gem5valid), .X0(CRNAA), .X1(REDA), .Y(GEM5A));
  MP2X #(.size(4)) inst516 (.S(gem5valid), .X0(CRNAB), .X1(REDB), .Y(GEM5B));
  MP2X #(.size(4)) inst517 (.S(gem5valid), .X0(CRNAC), .X1(REDC), .Y(GEM5C));
  REGX #(.size(10), .default_value(537)) inst135 (
    .clk(CLK), .data_out(inst135_data_out));  // open: ld, cl, inc, dec, data_in
  CMPX #(.size(10)) inst128 (.A(X), .B(inst135_data_out), .gr(inst128_gr));  // open: ls, eq
  REGX #(.size(10), .default_value(560)) inst137 (
    .clk(CLK), .data_out(inst137_data_out));  // open: ld, cl, inc, dec, data_in
  CMPX #(.size(10)) inst134 (.A(Y), .B(inst137_data_out), .gr(inst134_gr));  // open: ls, eq
  REGX #(.size(10), .default_value(546)) inst175 (
    .clk(CLK), .data_out(inst175_data_out));  // open: ld, cl, inc, dec, data_in
  CMPX #(.size(10)) inst168 (.A(X), .B(inst175_data_out), .gr(inst168_gr));  // open: ls, eq
  REGX #(.size(10), .default_value(560)) inst177 (
    .clk(CLK), .data_out(inst177_data_out));  // open: ld, cl, inc, dec, data_in
  CMPX #(.size(10)) inst174 (.A(Y), .B(inst177_data_out), .gr(inst174_gr));  // open: ls, eq
  REGX #(.size(10), .default_value(125)) inst228 (
    .clk(CLK), .data_out(inst228_data_out));  // open: ld, cl, inc, dec, data_in
  REGX #(.size(10), .default_value(568)) inst26 (
    .clk(CLK), .inc(inst261_out), .dec(inst262_out), .data_out(inst26_data_out));  // open: ld, cl, data_in
  CMPX #(.size(10)) inst17 (.A(X), .B(inst26_data_out), .ls(inst17_ls));  // open: eq, gr
  REGX #(.size(10), .default_value(551)) inst27 (
    .clk(CLK), .data_out(inst27_data_out));  // open: ld, cl, inc, dec, data_in
  CMPX #(.size(10)) inst23 (.A(Y), .B(inst27_data_out), .ls(inst23_ls));  // open: eq, gr
  REGX #(.size(1), .default_value(0)) inst231 (
    .clk(CLK), .ld(inst227_eq), .data_in(inst227_eq), .data_out(gg4));  // open: cl, inc, dec
  and inst21 (inst21_out, inst17_ls, inst11_gr);
  and inst24 (inst24_out, inst23_ls, inst119_gr);
  CMPX #(.size(10)) inst227 (.A(inst228_data_out), .B(inst229_data_out), .eq(inst227_eq));  // open: ls, gr
  and inst261 (inst261_out, nbitt, gravitacija);
  and inst262 (inst262_out, gravitacija, bitt);
  and inst25 (levooko, inst21_out, inst24_out);
  REGX #(.size(10), .default_value(542)) inst136 (
    .clk(CLK), .data_out(inst136_data_out));  // open: ld, cl, inc, dec, data_in
  CMPX #(.size(10)) inst129 (.A(X), .B(inst136_data_out), .ls(inst129_ls));  // open: eq, gr
  REGX #(.size(10), .default_value(565)) inst138 (
    .clk(CLK), .data_out(inst138_data_out));  // open: ld, cl, inc, dec, data_in
  CMPX #(.size(10)) inst131 (.A(Y), .B(inst138_data_out), .ls(inst131_ls));  // open: eq, gr
  REGX #(.size(10), .default_value(551)) inst176 (
    .clk(CLK), .data_out(inst176_data_out));  // open: ld, cl, inc, dec, data_in
  CMPX #(.size(10)) inst169 (.A(X), .B(inst176_data_out), .ls(inst169_ls));  // open: eq, gr
  REGX #(.size(10), .default_value(565)) inst178 (
    .clk(CLK), .data_out(inst178_data_out));  // open: ld, cl, inc, dec, data_in
  CMPX #(.size(10)) inst171 (.A(Y), .B(inst178_data_out), .ls(inst171_ls));  // open: eq, gr
  REGX #(.size(10), .default_value(150)) inst229 (
    .clk(CLK), .cl(inst227_eq), .dec(CRVENOSVETLO4), .data_out(inst229_data_out));  // open: ld, inc, data_in
  REGX #(.size(10), .default_value(560)) inst365 (
    .clk(CLK), .data_out(inst365_data_out));  // open: ld, cl, inc, dec, data_in
  REGX #(.size(10), .default_value(590)) inst105 (
    .clk(CLK), .inc(inst327_out), .dec(inst328_out), .data_out(inst105_data_out));  // open: ld, cl, data_in
  CMPX #(.size(10)) inst99 (.A(X), .B(inst105_data_out), .gr(inst99_gr));  // open: ls, eq
  REGX #(.size(10), .default_value(560)) inst107 (
    .clk(CLK), .data_out(inst107_data_out));  // open: ld, cl, inc, dec, data_in
  CMPX #(.size(10)) inst125 (.A(Y), .B(inst107_data_out), .gr(inst125_gr));  // open: ls, eq
  REGX #(.size(10), .default_value(537)) inst31 (
    .clk(CLK), .data_out(inst31_data_out));  // open: ld, cl, inc, dec, data_in
  CMPX #(.size(10)) inst120 (.A(Y), .B(inst31_data_out), .gr(inst120_gr));  // open: ls, eq
  and inst130 (inst130_out, inst129_ls, inst128_gr);
  and inst132 (inst132_out, inst131_ls, inst134_gr);
  and inst170 (inst170_out, inst169_ls, inst168_gr);
  and inst172 (inst172_out, inst171_ls, inst174_gr);
  REGX #(.size(10), .default_value(510)) inst363 (
    .clk(CLK), .inc(inst361_out), .dec(inst362_out), .data_out(inst363_data_out));  // open: ld, cl, data_in
  CMPX #(.size(10)) inst341 (.A(X), .B(inst363_data_out), .gr(inst341_gr));  // open: ls, eq
  CMPX #(.size(10)) inst353 (.A(Y), .B(inst365_data_out), .gr(inst353_gr));  // open: ls, eq
  REGX #(.size(10), .default_value(554)) inst35 (
    .clk(CLK), .inc(inst263_out), .dec(inst264_out), .data_out(inst35_data_out));  // open: ld, cl, data_in
  CMPX #(.size(10)) inst28 (.A(X), .B(inst35_data_out), .gr(inst28_gr));  // open: ls, eq
  and inst133 (gem1, inst130_out, inst132_out);
  and inst173 (gem2, inst170_out, inst172_out);
  and inst327 (inst327_out, nbitt, gravitacija);
  and inst328 (inst328_out, gravitacija, bitt);
  and inst232 (CRVENOSVETLO4, inst230_out, inst233_out);
  and inst361 (inst361_out, nbitt, gravitacija);
  and inst362 (inst362_out, gravitacija, bitt);
  and inst263 (inst263_out, nbitt, gravitacija);
  and inst264 (inst264_out, gravitacija, bitt);
  not inst233 (inst233_out, gg4);
  and inst230 (inst230_out, letenje, gem4valid);
  REGX #(.size(10), .default_value(555)) inst115 (
    .clk(CLK), .data_out(inst115_data_out));  // open: ld, cl, inc, dec, data_in
  CMPX #(.size(10)) inst109 (.A(X), .B(inst115_data_out), .gr(inst109_gr));  // open: ls, eq
  REGX #(.size(10), .default_value(560)) inst117 (
    .clk(CLK), .data_out(inst117_data_out));  // open: ld, cl, inc, dec, data_in
  CMPX #(.size(10)) inst126 (.A(Y), .B(inst117_data_out), .gr(inst126_gr));  // open: ls, eq
  REGX #(.size(10), .default_value(564)) inst164 (
    .clk(CLK), .data_out(inst164_data_out));  // open: ld, cl, inc, dec, data_in
  REGX #(.size(10), .default_value(560)) inst166 (
    .clk(CLK), .data_out(inst166_data_out));  // open: ld, cl, inc, dec, data_in
  CMPX #(.size(10)) inst163 (.A(Y), .B(inst166_data_out), .gr(inst163_gr));  // open: ls, eq
  REGX #(.size(10), .default_value(590)) inst367 (
    .clk(CLK), .data_out(inst367_data_out));  // open: ld, cl, inc, dec, data_in
  REGX #(.size(10), .default_value(605)) inst106 (
    .clk(CLK), .inc(inst325_out), .dec(inst326_out), .data_out(inst106_data_out));  // open: ld, cl, data_in
  CMPX #(.size(10)) inst100 (.A(X), .B(inst106_data_out), .ls(inst100_ls));  // open: eq, gr
  REGX #(.size(10), .default_value(590)) inst108 (
    .clk(CLK), .data_out(inst108_data_out));  // open: ld, cl, inc, dec, data_in
  CMPX #(.size(10)) inst102 (.A(Y), .B(inst108_data_out), .ls(inst102_ls));  // open: eq, gr
  REGX #(.size(10), .default_value(543)) inst37 (
    .clk(CLK), .data_out(inst37_data_out));  // open: ld, cl, inc, dec, data_in
  CMPX #(.size(10)) inst32 (.A(Y), .B(inst37_data_out), .ls(inst32_ls));  // open: eq, gr
  CMPX #(.size(10)) inst153 (.A(X), .B(inst164_data_out), .gr(inst153_gr));  // open: ls, eq
  REGX #(.size(10), .default_value(525)) inst364 (
    .clk(CLK), .inc(inst359_out), .dec(inst360_out), .data_out(inst364_data_out));  // open: ld, cl, data_in
  CMPX #(.size(10)) inst342 (.A(X), .B(inst364_data_out), .ls(inst342_ls));  // open: eq, gr
  CMPX #(.size(10)) inst347 (.A(Y), .B(inst367_data_out), .ls(inst347_ls));  // open: eq, gr
  REGX #(.size(10), .default_value(561)) inst36 (
    .clk(CLK), .inc(inst265_out), .dec(inst266_out), .data_out(inst36_data_out));  // open: ld, cl, data_in
  CMPX #(.size(10)) inst29 (.A(X), .B(inst36_data_out), .ls(inst29_ls));  // open: eq, gr
  REGX #(.size(10), .default_value(125)) inst235 (
    .clk(CLK), .data_out(inst235_data_out));  // open: ld, cl, inc, dec, data_in
  and inst348 (inst348_out, inst347_ls, inst353_gr);
  and inst101 (inst101_out, inst100_ls, inst99_gr);
  and inst103 (inst103_out, inst102_ls, inst125_gr);
  and inst30 (inst30_out, inst29_ls, inst28_gr);
  and inst33 (inst33_out, inst32_ls, inst120_gr);
  and inst343 (inst343_out, inst342_ls, inst341_gr);
  and inst325 (inst325_out, nbitt, gravitacija);
  and inst326 (inst326_out, gravitacija, bitt);
  REGX #(.size(1), .default_value(0)) inst238 (
    .clk(CLK), .ld(inst234_eq), .data_in(inst234_eq), .data_out(gg5));  // open: cl, inc, dec
  and inst359 (inst359_out, nbitt, gravitacija);
  and inst360 (inst360_out, gravitacija, bitt);
  and inst265 (inst265_out, nbitt, gravitacija);
  and inst266 (inst266_out, gravitacija, bitt);
  CMPX #(.size(10)) inst234 (.A(inst235_data_out), .B(inst236_data_out), .eq(inst234_eq));  // open: ls, gr
  and inst349 (levarukamirna, inst343_out, inst348_out);
  and inst104 (desnarukamirna, inst101_out, inst103_out);
  and inst34 (desnooko, inst30_out, inst33_out);
  REGX #(.size(10), .default_value(560)) inst116 (
    .clk(CLK), .data_out(inst116_data_out));  // open: ld, cl, inc, dec, data_in
  CMPX #(.size(10)) inst110 (.A(X), .B(inst116_data_out), .ls(inst110_ls));  // open: eq, gr
  REGX #(.size(10), .default_value(565)) inst127 (
    .clk(CLK), .data_out(inst127_data_out));  // open: ld, cl, inc, dec, data_in
  CMPX #(.size(10)) inst112 (.A(Y), .B(inst127_data_out), .ls(inst112_ls));  // open: eq, gr
  REGX #(.size(10), .default_value(569)) inst165 (
    .clk(CLK), .data_out(inst165_data_out));  // open: ld, cl, inc, dec, data_in
  REGX #(.size(10), .default_value(565)) inst167 (
    .clk(CLK), .data_out(inst167_data_out));  // open: ld, cl, inc, dec, data_in
  CMPX #(.size(10)) inst160 (.A(Y), .B(inst167_data_out), .ls(inst160_ls));  // open: eq, gr
  CMPX #(.size(10)) inst157 (.A(X), .B(inst165_data_out), .ls(inst157_ls));  // open: eq, gr
  and inst111 (inst111_out, inst110_ls, inst109_gr);
  and inst113 (inst113_out, inst112_ls, inst126_gr);
  and inst159 (inst159_out, inst157_ls, inst153_gr);
  and inst161 (inst161_out, inst160_ls, inst163_gr);
  REGX #(.size(10), .default_value(509)) inst370 (
    .clk(CLK), .inc(inst357_out), .dec(inst358_out), .data_out(inst370_data_out));  // open: ld, cl, data_in
  REGX #(.size(10), .default_value(590)) inst368 (
    .clk(CLK), .data_out(inst368_data_out));  // open: ld, cl, inc, dec, data_in
  CMPX #(.size(10)) inst340 (.A(Y), .B(inst368_data_out), .gr(inst340_gr));  // open: ls, eq
  REGX #(.size(10), .default_value(589)) inst98 (
    .clk(CLK), .inc(inst323_out), .dec(inst324_out), .data_out(inst98_data_out));  // open: ld, cl, data_in
  CMPX #(.size(10)) inst89 (.A(X), .B(inst98_data_out), .gr(inst89_gr));  // open: ls, eq
  REGX #(.size(10), .default_value(590)) inst96 (
    .clk(CLK), .data_out(inst96_data_out));  // open: ld, cl, inc, dec, data_in
  CMPX #(.size(10)) inst124 (.A(Y), .B(inst96_data_out), .gr(inst124_gr));  // open: ls, eq
  REGX #(.size(10), .default_value(535)) inst46 (
    .clk(CLK), .inc(inst267_out), .dec(inst268_out), .data_out(inst46_data_out));  // open: ld, cl, data_in
  CMPX #(.size(10)) inst38 (.A(X), .B(inst46_data_out), .gr(inst38_gr));  // open: ls, eq
  REGX #(.size(10), .default_value(513)) inst41 (
    .clk(CLK), .data_out(inst41_data_out));  // open: ld, cl, inc, dec, data_in
  CMPX #(.size(10)) inst121 (.A(Y), .B(inst41_data_out), .gr(inst121_gr));  // open: ls, eq
  REGX #(.size(10), .default_value(150)) inst236 (
    .clk(CLK), .cl(inst234_eq), .dec(CRVENOSVETLO5), .data_out(inst236_data_out));  // open: ld, inc, data_in
  CMPX #(.size(10)) inst141 (.A(X), .B(inst370_data_out), .gr(inst141_gr));  // open: ls, eq
  and inst114 (gem3, inst111_out, inst113_out);
  and inst162 (gem4, inst159_out, inst161_out);
  and inst323 (inst323_out, nbitt, gravitacija);
  and inst324 (inst324_out, gravitacija, bitt);
  and inst267 (inst267_out, nbitt, gravitacija);
  and inst268 (inst268_out, gravitacija, bitt);
  and inst357 (inst357_out, nbitt, gravitacija);
  and inst358 (inst358_out, gravitacija, bitt);
  REGX #(.size(10), .default_value(573)) inst186 (
    .clk(CLK), .data_out(inst186_data_out));  // open: ld, cl, inc, dec, data_in
  CMPX #(.size(10)) inst179 (.A(X), .B(inst186_data_out), .gr(inst179_gr));  // open: ls, eq
  REGX #(.size(10), .default_value(560)) inst188 (
    .clk(CLK), .data_out(inst188_data_out));  // open: ld, cl, inc, dec, data_in
  CMPX #(.size(10)) inst185 (.A(Y), .B(inst188_data_out), .gr(inst185_gr));  // open: ls, eq
  and inst239 (CRVENOSVETLO5, inst237_out, inst240_out);
  not inst240 (inst240_out, gg5);
  and inst237 (inst237_out, letenje, gem5valid);
  REGX #(.size(10), .default_value(526)) inst369 (
    .clk(CLK), .inc(inst354_out), .dec(inst355_out), .data_out(inst369_data_out));  // open: ld, cl, data_in
  REGX #(.size(10), .default_value(600)) inst366 (
    .clk(CLK), .data_out(inst366_data_out));  // open: ld, cl, inc, dec, data_in
  CMPX #(.size(10)) inst337 (.A(Y), .B(inst366_data_out), .ls(inst337_ls));  // open: eq, gr
  REGX #(.size(10), .default_value(606)) inst95 (
    .clk(CLK), .inc(inst321_out), .dec(inst322_out), .data_out(inst95_data_out));  // open: ld, cl, data_in
  CMPX #(.size(10)) inst90 (.A(X), .B(inst95_data_out), .ls(inst90_ls));  // open: eq, gr
  REGX #(.size(10), .default_value(600)) inst97 (
    .clk(CLK), .data_out(inst97_data_out));  // open: ld, cl, inc, dec, data_in
  CMPX #(.size(10)) inst92 (.A(Y), .B(inst97_data_out), .ls(inst92_ls));  // open: eq, gr
  REGX #(.size(10), .default_value(537)) inst47 (
    .clk(CLK), .inc(inst269_out), .dec(inst270_out), .data_out(inst47_data_out));  // open: ld, cl, data_in
  CMPX #(.size(10)) inst39 (.A(X), .B(inst47_data_out), .ls(inst39_ls));  // open: eq, gr
  REGX #(.size(10), .default_value(520)) inst45 (
    .clk(CLK), .data_out(inst45_data_out));  // open: ld, cl, inc, dec, data_in
  CMPX #(.size(10)) inst42 (.A(Y), .B(inst45_data_out), .ls(inst42_ls));  // open: eq, gr
  CMPX #(.size(10)) inst151 (.A(X), .B(inst369_data_out), .ls(inst151_ls));  // open: eq, gr
  and inst152 (inst152_out, inst151_ls, inst141_gr);
  and inst338 (inst338_out, inst337_ls, inst340_gr);
  and inst91 (inst91_out, inst90_ls, inst89_gr);
  and inst93 (inst93_out, inst92_ls, inst124_gr);
  and inst40 (inst40_out, inst39_ls, inst38_gr);
  and inst43 (inst43_out, inst42_ls, inst121_gr);
  and inst321 (inst321_out, nbitt, gravitacija);
  and inst322 (inst322_out, gravitacija, bitt);
  and inst269 (inst269_out, nbitt, gravitacija);
  and inst270 (inst270_out, gravitacija, bitt);
  and inst354 (inst354_out, nbitt, gravitacija);
  and inst355 (inst355_out, gravitacija, bitt);
  and inst94 (desnasakamirna, inst91_out, inst93_out);
  and inst44 (levaantena, inst40_out, inst43_out);
  REGX #(.size(10), .default_value(578)) inst187 (
    .clk(CLK), .data_out(inst187_data_out));  // open: ld, cl, inc, dec, data_in
  CMPX #(.size(10)) inst180 (.A(X), .B(inst187_data_out), .ls(inst180_ls));  // open: eq, gr
  REGX #(.size(10), .default_value(565)) inst189 (
    .clk(CLK), .data_out(inst189_data_out));  // open: ld, cl, inc, dec, data_in
  CMPX #(.size(10)) inst182 (.A(Y), .B(inst189_data_out), .ls(inst182_ls));  // open: eq, gr
  and inst339 (levasakamirna, inst152_out, inst338_out);
  and inst181 (inst181_out, inst180_ls, inst179_gr);
  and inst183 (inst183_out, inst182_ls, inst185_gr);
  REGX #(.size(10), .default_value(578)) inst54 (
    .clk(CLK), .inc(inst271_out), .dec(inst272_out), .data_out(inst54_data_out));  // open: ld, cl, data_in
  CMPX #(.size(10)) inst48 (.A(X), .B(inst54_data_out), .gr(inst48_gr));  // open: ls, eq
  REGX #(.size(10), .default_value(513)) inst56 (
    .clk(CLK), .data_out(inst56_data_out));  // open: ld, cl, inc, dec, data_in
  CMPX #(.size(10)) inst122 (.A(Y), .B(inst56_data_out), .gr(inst122_gr));  // open: ls, eq
  and inst184 (gem5, inst181_out, inst183_out);
  REGX #(.size(10), .default_value(535)) inst67 (
    .clk(CLK), .inc(inst319_out), .dec(inst320_out), .data_out(inst67_data_out));  // open: ld, cl, data_in
  CMPX #(.size(10)) instxxx (.A(X), .B(inst67_data_out), .gr(instxxx_gr));  // open: ls, eq
  REGX #(.size(10), .default_value(580)) inst64 (
    .clk(CLK), .data_out(inst64_data_out));  // open: ld, cl, inc, dec, data_in
  CMPX #(.size(10)) inst123 (.A(Y), .B(inst64_data_out), .gr(inst123_gr));  // open: ls, eq
  REGX #(.size(10), .default_value(485)) inst305 (
    .clk(CLK), .inc(inst329_out), .dec(inst330_out), .data_out(inst305_data_out));  // open: ld, cl, data_in
  CMPX #(.size(10)) inst295 (.A(X), .B(inst305_data_out), .gr(inst295_gr));  // open: ls, eq
  REGX #(.size(10), .default_value(559)) inst302 (
    .clk(CLK), .data_out(inst302_data_out));  // open: ld, cl, inc, dec, data_in
  CMPX #(.size(10)) inst301 (.A(Y), .B(inst302_data_out), .gr(inst301_gr));  // open: ls, eq
  REGX #(.size(10), .default_value(620)) inst409 (
    .clk(CLK), .inc(inst385_out), .dec(inst386_out), .data_out(inst409_data_out));  // open: ld, cl, data_in
  REGX #(.size(10), .default_value(559)) inst410 (
    .clk(CLK), .data_out(inst410_data_out));  // open: ld, cl, inc, dec, data_in
  CMPX #(.size(10)) inst384 (.A(Y), .B(inst410_data_out), .gr(inst384_gr));  // open: ls, eq
  CMPX #(.size(10)) inst378 (.A(X), .B(inst409_data_out), .gr(inst378_gr));  // open: ls, eq
  and inst271 (inst271_out, nbitt, gravitacija);
  and inst272 (inst272_out, gravitacija, bitt);
  and inst319 (inst319_out, nbitt, gravitacija);
  and inst320 (inst320_out, gravitacija, bitt);
  and inst329 (inst329_out, nbitt, gravitacija);
  and inst330 (inst330_out, gravitacija, bitt);
  REGX #(.size(10), .default_value(580)) inst55 (
    .clk(CLK), .inc(inst273_out), .dec(inst274_out), .data_out(inst55_data_out));  // open: ld, cl, data_in
  CMPX #(.size(10)) inst49 (.A(X), .B(inst55_data_out), .ls(inst49_ls));  // open: eq, gr
  REGX #(.size(10), .default_value(520)) inst57 (
    .clk(CLK), .data_out(inst57_data_out));  // open: ld, cl, inc, dec, data_in
  CMPX #(.size(10)) inst51 (.A(Y), .B(inst57_data_out), .ls(inst51_ls));  // open: eq, gr
  and inst385 (inst385_out, nbitt, gravitacija);
  and inst386 (inst386_out, gravitacija, bitt);
  REGX #(.size(10), .default_value(580)) inst66 (
    .clk(CLK), .inc(inst317_out), .dec(inst318_out), .data_out(inst66_data_out));  // open: ld, cl, data_in
  CMPX #(.size(10)) inst59 (.A(X), .B(inst66_data_out), .ls(inst59_ls));  // open: eq, gr
  REGX #(.size(10), .default_value(590)) inst65 (
    .clk(CLK), .data_out(inst65_data_out));  // open: ld, cl, inc, dec, data_in
  CMPX #(.size(10)) inst61 (.A(Y), .B(inst65_data_out), .ls(inst61_ls));  // open: eq, gr
  REGX #(.size(10), .default_value(495)) inst304 (
    .clk(CLK), .inc(inst331_out), .dec(inst332_out), .data_out(inst304_data_out));  // open: ld, cl, data_in
  CMPX #(.size(10)) inst296 (.A(X), .B(inst304_data_out), .ls(inst296_ls));  // open: eq, gr
  REGX #(.size(10), .default_value(576)) inst303 (
    .clk(CLK), .data_out(inst303_data_out));  // open: ld, cl, inc, dec, data_in
  CMPX #(.size(10)) inst298 (.A(Y), .B(inst303_data_out), .ls(inst298_ls));  // open: eq, gr
  REGX #(.size(10), .default_value(630)) inst408 (
    .clk(CLK), .inc(inst387_out), .dec(inst391_out), .data_out(inst408_data_out));  // open: ld, cl, data_in
  REGX #(.size(10), .default_value(576)) inst411 (
    .clk(CLK), .data_out(inst411_data_out));  // open: ld, cl, inc, dec, data_in
  CMPX #(.size(10)) inst381 (.A(Y), .B(inst411_data_out), .ls(inst381_ls));  // open: eq, gr
  and inst62 (inst62_out, inst61_ls, inst123_gr);
  and inst50 (inst50_out, inst49_ls, inst48_gr);
  and inst52 (inst52_out, inst51_ls, inst122_gr);
  CMPX #(.size(10)) inst379 (.A(X), .B(inst408_data_out), .ls(inst379_ls));  // open: eq, gr
  and inst60 (inst60_out, inst59_ls, instxxx_gr);
  and inst273 (inst273_out, nbitt, gravitacija);
  and inst274 (inst274_out, gravitacija, bitt);
  and inst299 (inst299_out, inst298_ls, inst301_gr);
  and inst317 (inst317_out, nbitt, gravitacija);
  and inst318 (inst318_out, gravitacija, bitt);
  and inst53 (desnaantena, inst50_out, inst52_out);
  and inst297 (inst297_out, inst296_ls, inst295_gr);
  and inst380 (inst380_out, inst379_ls, inst378_gr);
  and inst382 (inst382_out, inst381_ls, inst384_gr);
  and inst63 (usta, inst60_out, inst62_out);
  and inst331 (inst331_out, nbitt, gravitacija);
  and inst332 (inst332_out, gravitacija, bitt);
  and inst300 (levasakapokret, inst297_out, inst299_out);
  and inst387 (inst387_out, nbitt, gravitacija);
  and inst391 (inst391_out, gravitacija, bitt);
  and inst383 (desnasakapokret, inst380_out, inst382_out);
  REGX #(.size(10), .default_value(580)) inst400 (
    .clk(CLK), .data_out(inst400_data_out));  // open: ld, cl, inc, dec, data_in
  CMPX #(.size(10)) inst403 (.A(Y), .B(inst400_data_out), .gr(inst403_gr));  // open: ls, eq
  REGX #(.size(10), .default_value(580)) inst419 (
    .clk(CLK), .data_out(inst419_data_out));  // open: ld, cl, inc, dec, data_in
  REGX #(.size(10), .default_value(560)) inst293 (
    .clk(CLK), .data_out(inst293_data_out));  // open: ld, cl, inc, dec, data_in
  CMPX #(.size(10)) inst292 (.A(Y), .B(inst293_data_out), .gr(inst292_gr));  // open: ls, eq
  REGX #(.size(10), .default_value(535)) inst402 (
    .clk(CLK), .inc(inst315_out), .dec(inst316_out), .data_out(inst402_data_out));  // open: ld, cl, data_in
  CMPX #(.size(10)) inst388 (.A(X), .B(inst402_data_out), .gr(inst388_gr));  // open: ls, eq
  REGX #(.size(10), .default_value(544)) inst421 (
    .clk(CLK), .inc(inst275_out), .dec(inst276_out), .data_out(inst421_data_out));  // open: ld, cl, data_in
  CMPX #(.size(10)) inst412 (.A(X), .B(inst421_data_out), .gr(inst412_gr));  // open: ls, eq
  CMPX #(.size(10)) inst422 (.A(Y), .B(inst419_data_out), .gr(inst422_gr));  // open: ls, eq
  REGX #(.size(10), .default_value(495)) inst307 (
    .clk(CLK), .inc(inst333_out), .dec(inst334_out), .data_out(inst307_data_out));  // open: ld, cl, data_in
  CMPX #(.size(10)) inst286 (.A(X), .B(inst307_data_out), .gr(inst286_gr));  // open: ls, eq
  REGX #(.size(10), .default_value(590)) inst404 (
    .clk(CLK), .inc(inst392_out), .dec(inst393_out), .data_out(inst404_data_out));  // open: ld, cl, data_in
  CMPX #(.size(10)) inst371 (.A(X), .B(inst404_data_out), .gr(inst371_gr));  // open: ls, eq
  REGX #(.size(10), .default_value(560)) inst406 (
    .clk(CLK), .data_out(inst406_data_out));  // open: ld, cl, inc, dec, data_in
  CMPX #(.size(10)) inst377 (.A(Y), .B(inst406_data_out), .gr(inst377_gr));  // open: ls, eq
  and inst315 (inst315_out, nbitt, gravitacija);
  and inst316 (inst316_out, gravitacija, bitt);
  and inst275 (inst275_out, nbitt, gravitacija);
  and inst276 (inst276_out, gravitacija, bitt);
  and inst333 (inst333_out, nbitt, gravitacija);
  and inst334 (inst334_out, gravitacija, bitt);
  and inst392 (inst392_out, nbitt, gravitacija);
  and inst393 (inst393_out, gravitacija, bitt);
  REGX #(.size(10), .default_value(590)) inst401 (
    .clk(CLK), .data_out(inst401_data_out));  // open: ld, cl, inc, dec, data_in
  CMPX #(.size(10)) inst396 (.A(Y), .B(inst401_data_out), .ls(inst396_ls));  // open: eq, gr
  REGX #(.size(10), .default_value(590)) inst420 (
    .clk(CLK), .data_out(inst420_data_out));  // open: ld, cl, inc, dec, data_in
  REGX #(.size(10), .default_value(575)) inst294 (
    .clk(CLK), .data_out(inst294_data_out));  // open: ld, cl, inc, dec, data_in
  CMPX #(.size(10)) inst289 (.A(Y), .B(inst294_data_out), .ls(inst289_ls));  // open: eq, gr
  REGX #(.size(10), .default_value(544)) inst399 (
    .clk(CLK), .inc(inst313_out), .dec(inst314_out), .data_out(inst399_data_out));  // open: ld, cl, data_in
  CMPX #(.size(10)) inst389 (.A(X), .B(inst399_data_out), .ls(inst389_ls));  // open: eq, gr
  REGX #(.size(10), .default_value(553)) inst418 (
    .clk(CLK), .inc(inst277_out), .dec(inst278_out), .data_out(inst418_data_out));  // open: ld, cl, data_in
  CMPX #(.size(10)) inst413 (.A(X), .B(inst418_data_out), .ls(inst413_ls));  // open: eq, gr
  CMPX #(.size(10)) inst415 (.A(Y), .B(inst420_data_out), .ls(inst415_ls));  // open: eq, gr
  REGX #(.size(10), .default_value(525)) inst306 (
    .clk(CLK), .inc(inst335_out), .dec(inst336_out), .data_out(inst306_data_out));  // open: ld, cl, data_in
  CMPX #(.size(10)) inst287 (.A(X), .B(inst306_data_out), .ls(inst287_ls));  // open: eq, gr
  REGX #(.size(10), .default_value(620)) inst405 (
    .clk(CLK), .inc(inst394_out), .dec(inst395_out), .data_out(inst405_data_out));  // open: ld, cl, data_in
  CMPX #(.size(10)) inst372 (.A(X), .B(inst405_data_out), .ls(inst372_ls));  // open: eq, gr
  REGX #(.size(10), .default_value(575)) inst407 (
    .clk(CLK), .data_out(inst407_data_out));  // open: ld, cl, inc, dec, data_in
  CMPX #(.size(10)) inst374 (.A(Y), .B(inst407_data_out), .ls(inst374_ls));  // open: eq, gr
  and inst390 (inst390_out, inst389_ls, inst388_gr);
  and inst397 (inst397_out, inst396_ls, inst403_gr);
  and inst416 (inst416_out, inst415_ls, inst422_gr);
  and inst288 (inst288_out, inst287_ls, inst286_gr);
  and inst290 (inst290_out, inst289_ls, inst292_gr);
  and inst414 (inst414_out, inst413_ls, inst412_gr);
  and inst373 (inst373_out, inst372_ls, inst371_gr);
  and inst375 (inst375_out, inst374_ls, inst377_gr);
  and inst313 (inst313_out, nbitt, gravitacija);
  and inst314 (inst314_out, gravitacija, bitt);
  and inst277 (inst277_out, nbitt, gravitacija);
  and inst278 (inst278_out, gravitacija, bitt);
  and inst335 (inst335_out, nbitt, gravitacija);
  and inst336 (inst336_out, gravitacija, bitt);
  and inst394 (inst394_out, nbitt, gravitacija);
  and inst395 (inst395_out, gravitacija, bitt);
  and inst398 (s1v, inst390_out, inst397_out);
  and inst417 (s2v, inst414_out, inst416_out);
  and inst291 (levarukapokret, inst288_out, inst290_out);
  and inst376 (desnarukapokret, inst373_out, inst375_out);
  REGX #(.size(10), .default_value(553)) inst467 (
    .clk(CLK), .inc(inst311_out), .dec(inst312_out), .data_out(inst467_data_out));  // open: ld, cl, data_in
  CMPX #(.size(10)) inst431 (.A(X), .B(inst467_data_out), .gr(inst431_gr));  // open: ls, eq
  REGX #(.size(10), .default_value(580)) inst437 (
    .clk(CLK), .data_out(inst437_data_out));  // open: ld, cl, inc, dec, data_in
  CMPX #(.size(10)) inst439 (.A(Y), .B(inst437_data_out), .gr(inst439_gr));  // open: ls, eq
  REGX #(.size(10), .default_value(562)) inst457 (
    .clk(CLK), .inc(inst279_out), .dec(inst280_out), .data_out(inst457_data_out));  // open: ld, cl, data_in
  CMPX #(.size(10)) inst448 (.A(X), .B(inst457_data_out), .gr(inst448_gr));  // open: ls, eq
  REGX #(.size(10), .default_value(580)) inst455 (
    .clk(CLK), .data_out(inst455_data_out));  // open: ld, cl, inc, dec, data_in
  CMPX #(.size(10)) inst458 (.A(Y), .B(inst455_data_out), .gr(inst458_gr));  // open: ls, eq
  and inst311 (inst311_out, nbitt, gravitacija);
  and inst312 (inst312_out, gravitacija, bitt);
  and inst279 (inst279_out, nbitt, gravitacija);
  and inst280 (inst280_out, gravitacija, bitt);
  REGX #(.size(10), .default_value(562)) inst468 (
    .clk(CLK), .inc(inst309_out), .dec(inst310_out), .data_out(inst468_data_out));  // open: ld, cl, data_in
  CMPX #(.size(10)) inst432 (.A(X), .B(inst468_data_out), .ls(inst432_ls));  // open: eq, gr
  REGX #(.size(10), .default_value(590)) inst438 (
    .clk(CLK), .data_out(inst438_data_out));  // open: ld, cl, inc, dec, data_in
  CMPX #(.size(10)) inst434 (.A(Y), .B(inst438_data_out), .ls(inst434_ls));  // open: eq, gr
  REGX #(.size(10), .default_value(571)) inst454 (
    .clk(CLK), .inc(inst281_out), .dec(inst282_out), .data_out(inst454_data_out));  // open: ld, cl, data_in
  CMPX #(.size(10)) inst449 (.A(X), .B(inst454_data_out), .ls(inst449_ls));  // open: eq, gr
  REGX #(.size(10), .default_value(590)) inst456 (
    .clk(CLK), .data_out(inst456_data_out));  // open: ld, cl, inc, dec, data_in
  CMPX #(.size(10)) inst451 (.A(Y), .B(inst456_data_out), .ls(inst451_ls));  // open: eq, gr
  and inst435 (inst435_out, inst434_ls, inst439_gr);
  and inst433 (inst433_out, inst432_ls, inst431_gr);
  and inst450 (inst450_out, inst449_ls, inst448_gr);
  and inst452 (inst452_out, inst451_ls, inst458_gr);
  and inst309 (inst309_out, nbitt, gravitacija);
  and inst310 (inst310_out, gravitacija, bitt);
  and inst281 (inst281_out, nbitt, gravitacija);
  and inst282 (inst282_out, gravitacija, bitt);
  and inst436 (s3v, inst433_out, inst435_out);
  and inst453 (s4v, inst450_out, inst452_out);
  REGX #(.size(10), .default_value(571)) inst486 (
    .clk(CLK), .inc(inst283_out), .dec(inst284_out), .data_out(inst486_data_out));  // open: ld, cl, data_in
  REGX #(.size(10), .default_value(580)) inst475 (
    .clk(CLK), .data_out(inst475_data_out));  // open: ld, cl, inc, dec, data_in
  CMPX #(.size(10)) inst477 (.A(Y), .B(inst475_data_out), .gr(inst477_gr));  // open: ls, eq
  CMPX #(.size(10)) inst469 (.A(X), .B(inst486_data_out), .gr(inst469_gr));  // open: ls, eq
